# EAGLE design Fathom-S (EAGLE 7.4.0)

## Sheet 1 of 8
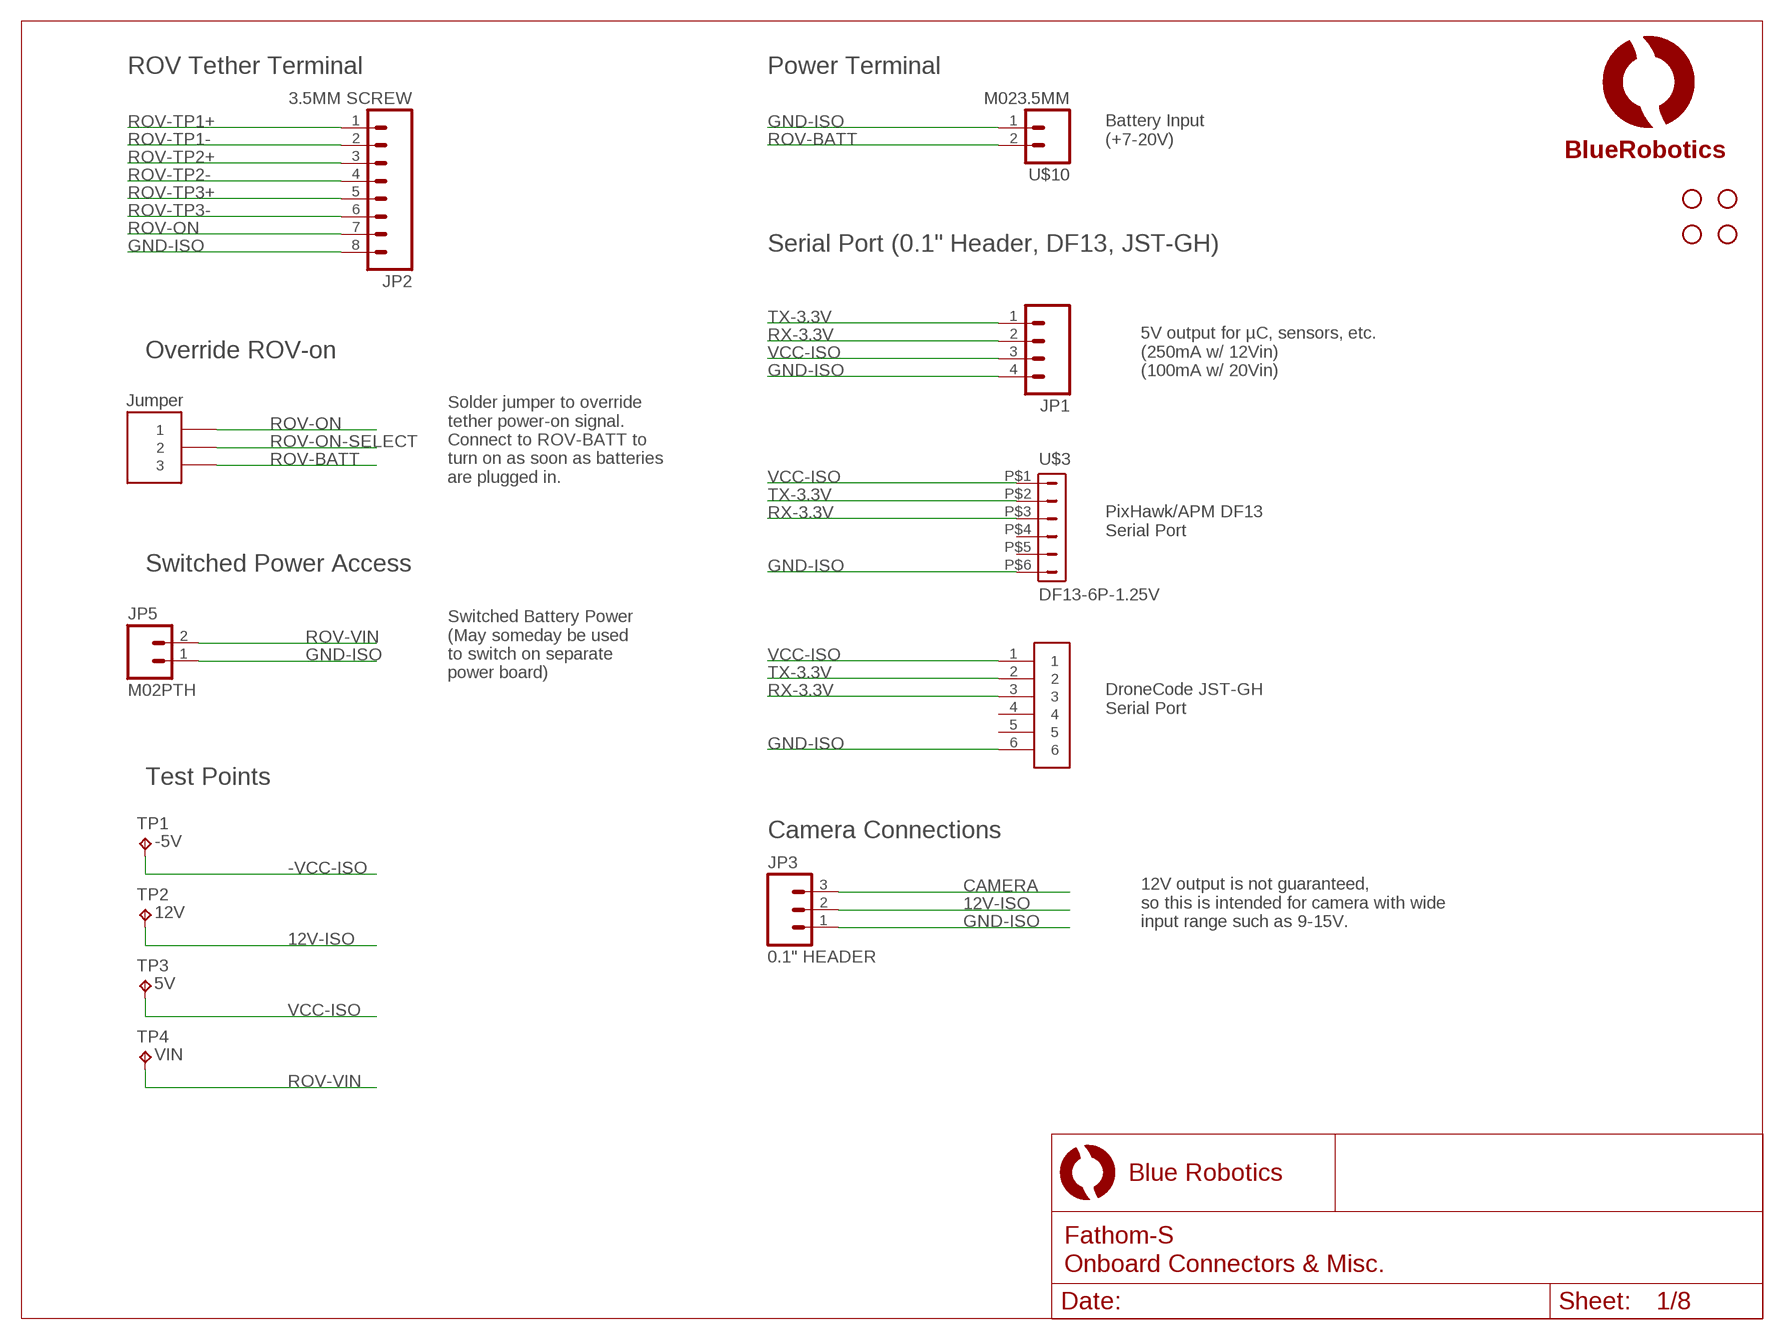
[diagram p0: schematic, sheet 1]

### Parts
JP1  M04PTH  [1X04]
JP2  3.5MM SCREW  M083.5MM-8  [SCREWTERMINAL-3.5MM-8]
JP3  0.1" HEADER  M03PTH  [1X03]
JP5  M02PTH  [1X02]
STANDOFF1  STAND-OFF  [STAND-OFF]
STANDOFF2  STAND-OFF  [STAND-OFF]
STANDOFF3  STAND-OFF  [STAND-OFF]
STANDOFF4  STAND-OFF  [STAND-OFF]
TP1  -5V  TEST-POINT  [B1,27]
TP2  12V  TEST-POINT  [B1,27]
TP3  5V  TEST-POINT  [B1,27]
TP4  VIN  TEST-POINT  [B1,27]
U$3  DF13-6P-1.25V  [DF13C-6P-1.25V]
U$4  LOGOFULL-M  [BR-FULL-LOGO-MEDIUM]
U$10  M023.5MM  [SCREWTERMINAL-3.5MM-2]
U$11  JST-GH-6TOP-ENTRY  [JST-GH-TOP-6]
U$13  HEADER-33MM  [HEADER-2MM-3POS]

### Nets
12V-ISO: JP3.2 TP2.TP ; also sheet 4
-VCC-ISO: TP1.TP ; also sheet 4,6
CAMERA: JP3.3 ; also sheet 6
GND-ISO: JP1.4 JP2.8 JP3.1 JP5.1 U$3.P$6 U$10.1 U$11.6 ; also sheet 3,4,5,6,8
ROV-BATT: U$10.2 U$13.P$3 ; also sheet 5
ROV-ON: JP2.7 U$13.P$1
ROV-ON-SELECT: U$13.P$2 ; also sheet 5
ROV-TP1+: JP2.1 ; also sheet 6
ROV-TP1-: JP2.2 ; also sheet 6
ROV-TP2+: JP2.3 ; also sheet 8
ROV-TP2-: JP2.4 ; also sheet 8
ROV-TP3+: JP2.5 ; also sheet 8
ROV-TP3-: JP2.6 ; also sheet 8
ROV-VIN: JP5.2 TP4.TP ; also sheet 4,5
RX-3.3V: JP1.2 U$3.P$3 U$11.3 ; also sheet 8
TX-3.3V: JP1.1 U$3.P$2 U$11.2 ; also sheet 8
VCC-ISO: JP1.3 TP3.TP U$3.P$1 U$11.1 ; also sheet 3,4,6,8
Unconnected: U$3.P$4 U$3.P$5 U$11.4 U$11.5

### Notes on the sheet
- ROV Tether Terminal | Power Terminal
- Battery Input
  (+7-20V)
- Serial Port (0.1" Header, DF13, JST-GH)
- Override ROV-on
- 5V output for µC, sensors, etc.
  (250mA w/ 12Vin)
  (100mA w/ 20Vin)
- Jumper
- Solder jumper to override
  tether power-on signal. 
  Connect to ROV-BATT to 
  turn on as soon as batteries
  are plugged in.
- PixHawk/APM DF13
  Serial Port
- Switched Power Access
- Switched Battery Power
  (May someday be used
  to switch on separate
  power board)
- DroneCode JST-GH
  Serial Port
- Test Points
- Camera Connections
- 12V output is not guaranteed, 
  so this is intended for camera with wide 
  input range such as 9-15V.

## Sheet 2 of 8
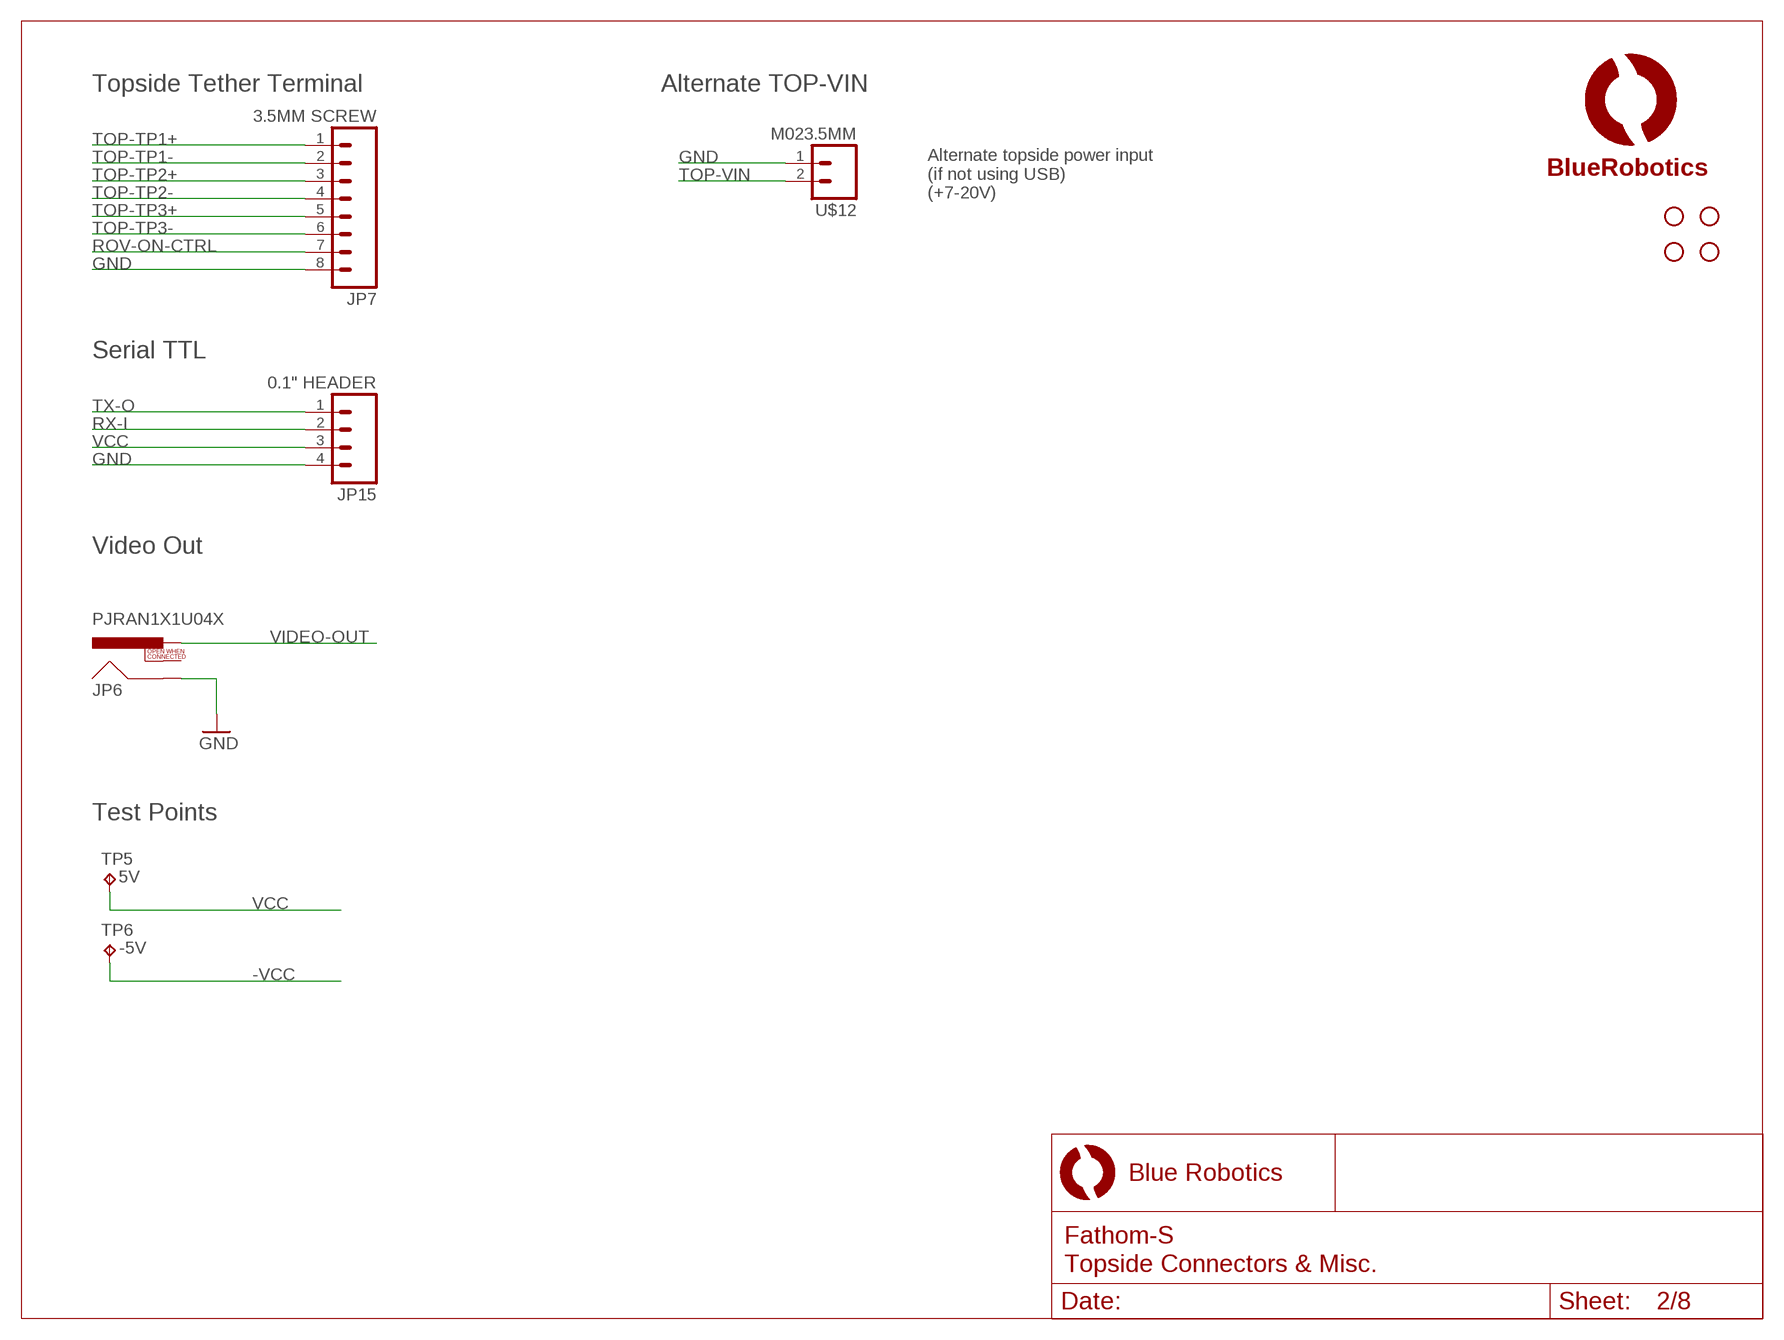
[diagram p1: schematic, sheet 2]

### Parts
JP6  PJRAN1X1U04X  RCA  [RCA]
JP7  3.5MM SCREW  M083.5MM-8  [SCREWTERMINAL-3.5MM-8]
JP15  0.1" HEADER  M04PTH  [1X04]
STANDOFF5  STAND-OFF  [STAND-OFF]
STANDOFF6  STAND-OFF  [STAND-OFF]
STANDOFF7  STAND-OFF  [STAND-OFF]
STANDOFF8  STAND-OFF  [STAND-OFF]
TP5  5V  TEST-POINT  [B1,27]
TP6  -5V  TEST-POINT  [B1,27]
U$5  LOGOBR-LOGO-MS-COPPER  [BR-LOGO-MEDIUM-SMALL-COPPER]
U$12  M023.5MM  [SCREWTERMINAL-3.5MM-2]

### Nets
-VCC: TP6.TP ; also sheet 4,6
GND: JP6.SHELL JP7.8 JP15.4 U$12.1 ; also sheet 3,4,6,7
ROV-ON-CTRL: JP7.7 ; also sheet 7
RX-I: JP15.2 ; also sheet 7
TOP-TP1+: JP7.1 ; also sheet 6
TOP-TP1-: JP7.2 ; also sheet 6
TOP-TP2+: JP7.3 ; also sheet 7
TOP-TP2-: JP7.4 ; also sheet 7
TOP-TP3+: JP7.5 ; also sheet 7
TOP-TP3-: JP7.6 ; also sheet 7
TOP-VIN: U$12.2 ; also sheet 4
TX-O: JP15.1 ; also sheet 7
VCC: JP15.3 TP5.TP ; also sheet 3,4,6,7
VIDEO-OUT: JP6.PIN ; also sheet 6
Unconnected: JP6.SWITCH

### Notes on the sheet
- Topside Tether Terminal | Alternate TOP-VIN
- Alternate topside power input 
  (if not using USB)
  (+7-20V)
- Serial TTL
- Video Out
- Test Points

## Sheet 3 of 8
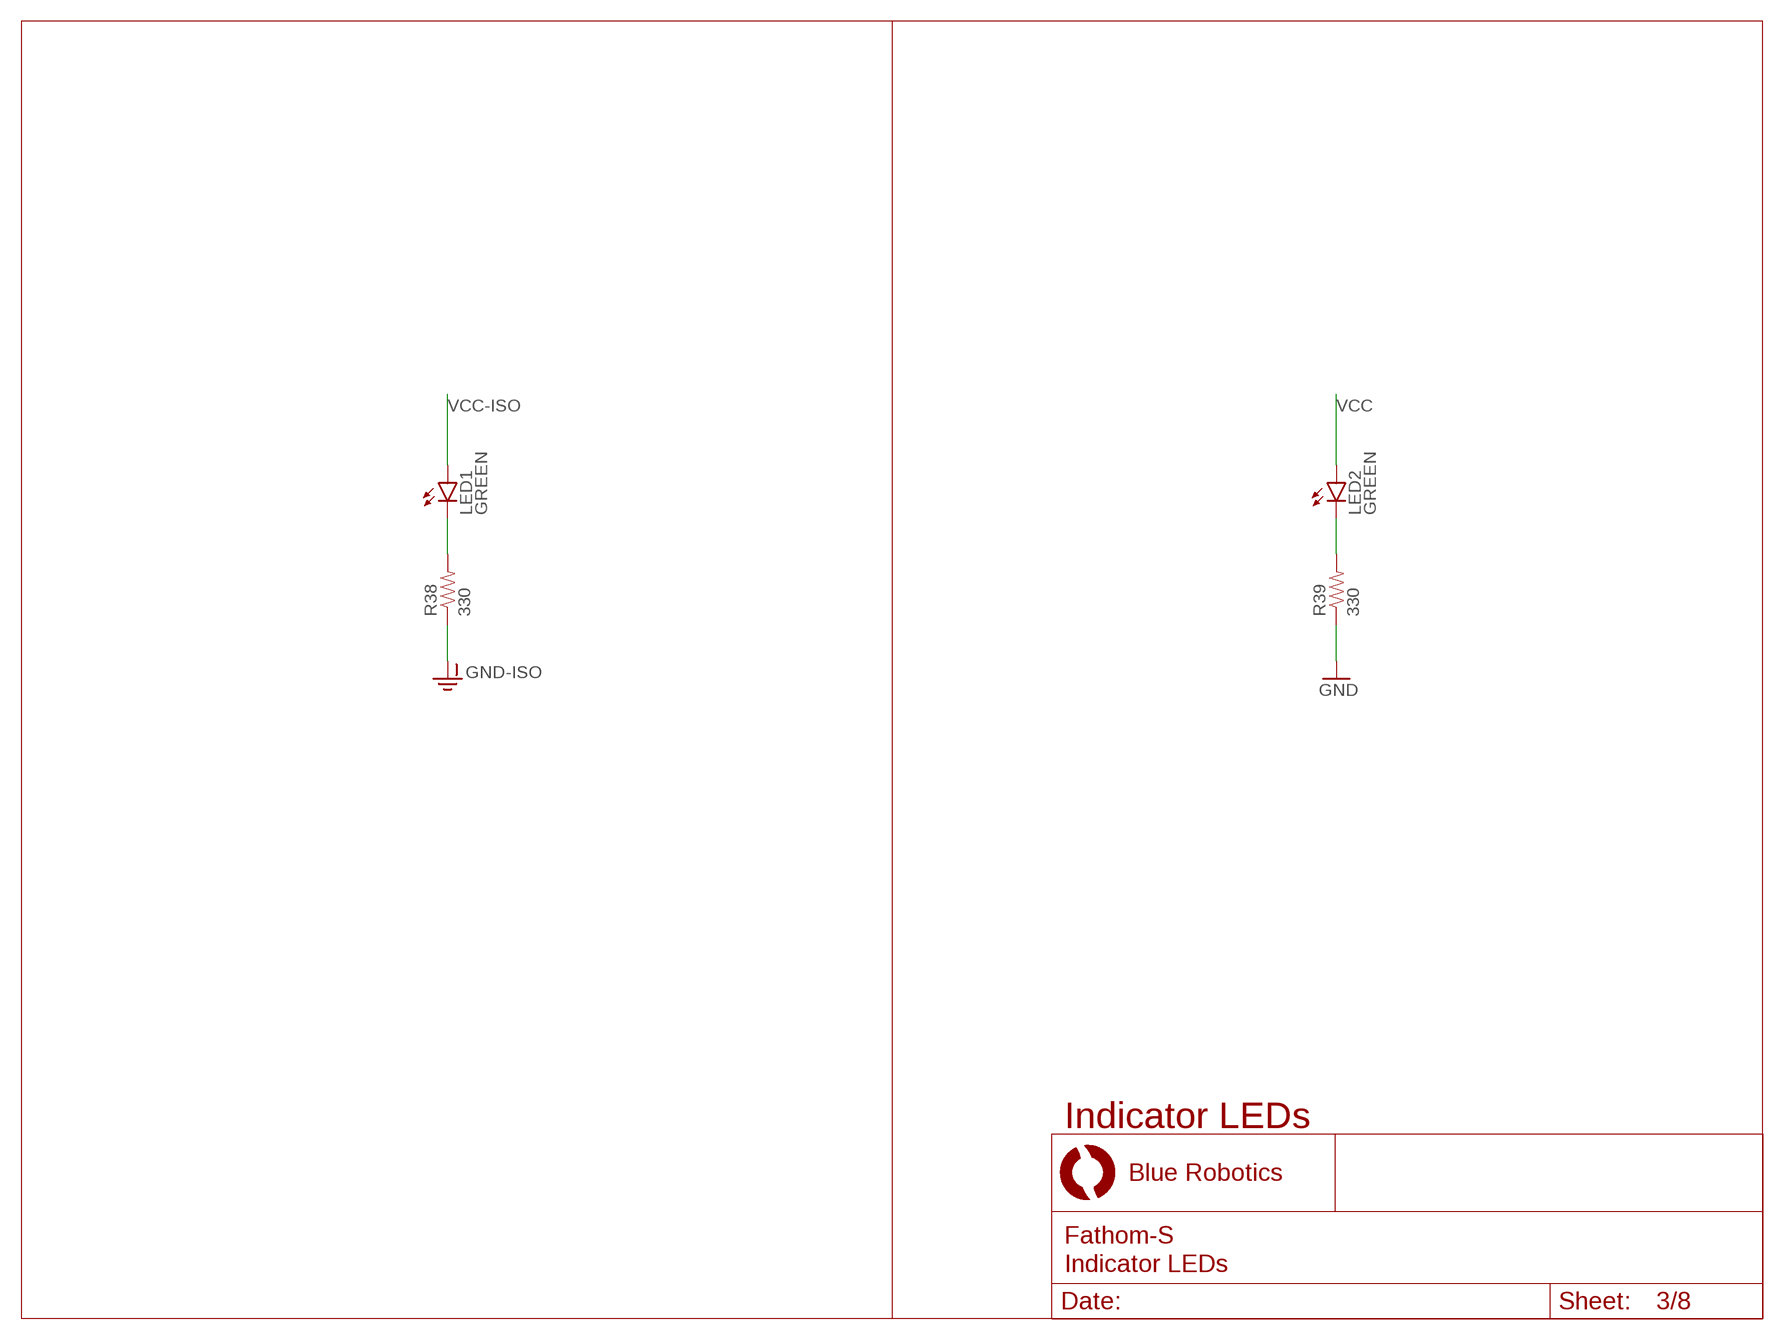
[diagram p2: schematic, sheet 3]

### Parts
LED1  GREEN  LED0603  [LED-0603]
LED2  GREEN  LED0603  [LED-0603]
R38  330  33KOHM1/10W1%(0603)  [0603-RES]
R39  330  33KOHM1/10W1%(0603)  [0603-RES]

### Nets
GND: R39.1 ; also sheet 2,4,6,7
GND-ISO: R38.1 ; also sheet 1,4,5,6,8
N$31: LED1.C R38.2
N$32: LED2.C R39.2
VCC: LED2.A ; also sheet 2,4,6,7
VCC-ISO: LED1.A ; also sheet 1,4,6,8

### Notes on the sheet
- Indicator LEDs

## Sheet 4 of 8
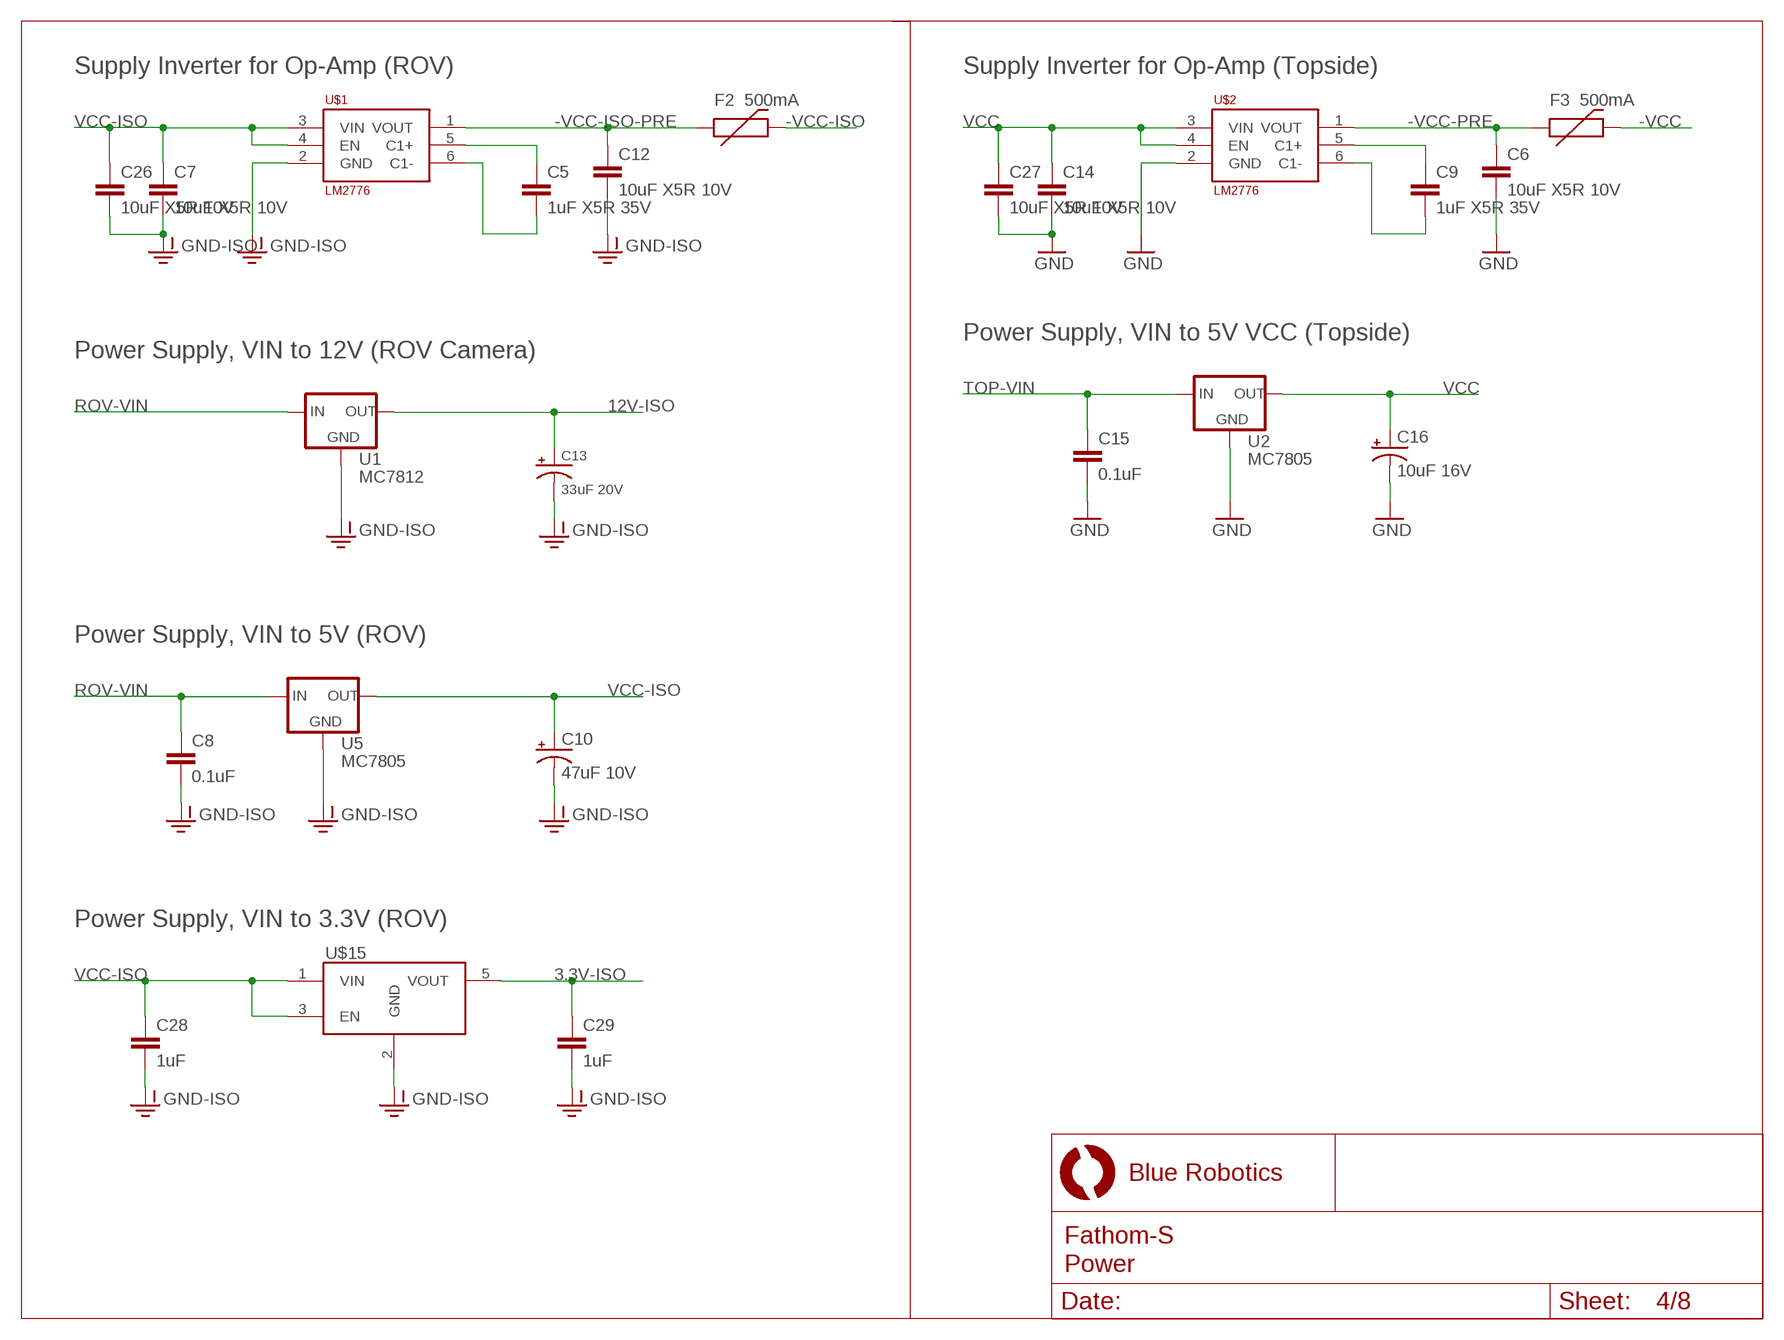
[diagram p3: schematic, sheet 4]

### Parts
C5  1uF X5R 35V  CAP0603-CAP  [0603-CAP]
C6  10uF X5R 10V  CAP0805  [0805]
C7  10uF X5R 10V  CAP0805  [0805]
C8  0.1uF  CAP0603-CAP  [0603-CAP]
C9  1uF X5R 35V  CAP0603-CAP  [0603-CAP]
C10  47uF 10V  CAP_POL3528  [EIA3528]
C12  10uF X5R 10V  CAP0805  [0805]
C13  33uF 20V  CAPACITOR-POLAR2413  [C2413]
C14  10uF X5R 10V  CAP0805  [0805]
C15  0.1uF  CAP0603-CAP  [0603-CAP]
C16  10uF 16V  CAP_POL1206  [EIA3216]
C26  10uF X5R 10V  CAP0805  [0805]
C27  10uF X5R 10V  CAP0805  [0805]
C28  1uF  CAP0603-CAP  [0603-CAP]
C29  1uF  CAP0603-CAP  [0603-CAP]
F2  500mA  PTC0603  [0603]
F3  500mA  PTC0603  [0603]
U1  MC7812  78XX  [DPAK]
U2  MC7805  78XX  [DPAK]
U5  MC7805  78XX  [DPAK]
U$1  LM2776  [SOT-23-6]
U$2  LM2776  [SOT-23-6]
U$15  VREG-MIC5365  [SC70-5L]

### Nets
3.3V-ISO: C29.1 U$15.5(VOUT) ; also sheet 8
12V-ISO: C13.+ U1.3(OUT) ; also sheet 1
-VCC: F3.2 ; also sheet 2,6
-VCC-ISO: F2.2 ; also sheet 1,6
-VCC-ISO-PRE: C12.1 F2.1 U$1.1(VOUT)
-VCC-PRE: C6.1 F3.1 U$2.1(VOUT)
GND: C6.2 C14.2 C15.2 C16.C(-) C27.2 U2.4(GND) U$2.2(GND) ; also sheet 2,3,6,7
GND-ISO: C7.2 C8.2 C10.C(-) C12.2 C13.- C26.2 C28.2 C29.2 U1.4(GND) U5.4(GND) U$1.2(GND) U$15.2(GND) ; also sheet 1,3,5,6,8
N$3: C9.1 U$2.5(C1+)
N$4: C9.2 U$2.6(C1-)
N$10: C5.1 U$1.5(C1+)
N$11: C5.2 U$1.6(C1-)
ROV-VIN: C8.1 U1.1(IN) U5.1(IN) ; also sheet 1,5
TOP-VIN: C15.1 U2.1(IN) ; also sheet 2
VCC: C14.1 C16.A(+) C27.1 U2.3(OUT) U$2.3(VIN) U$2.4(EN) ; also sheet 2,3,6,7
VCC-ISO: C7.1 C10.A(+) C26.1 C28.1 U5.3(OUT) U$1.3(VIN) U$1.4(EN) U$15.1(VIN) U$15.3(EN) ; also sheet 1,3,6,8

### Notes on the sheet
- Supply Inverter for Op-Amp (ROV) | Supply Inverter for Op-Amp (Topside)
- Power Supply, VIN to 5V VCC (Topside)
- Power Supply, VIN to 12V (ROV Camera)
- Power Supply, VIN to 5V (ROV)
- Power Supply, VIN to 3.3V (ROV)

## Sheet 5 of 8
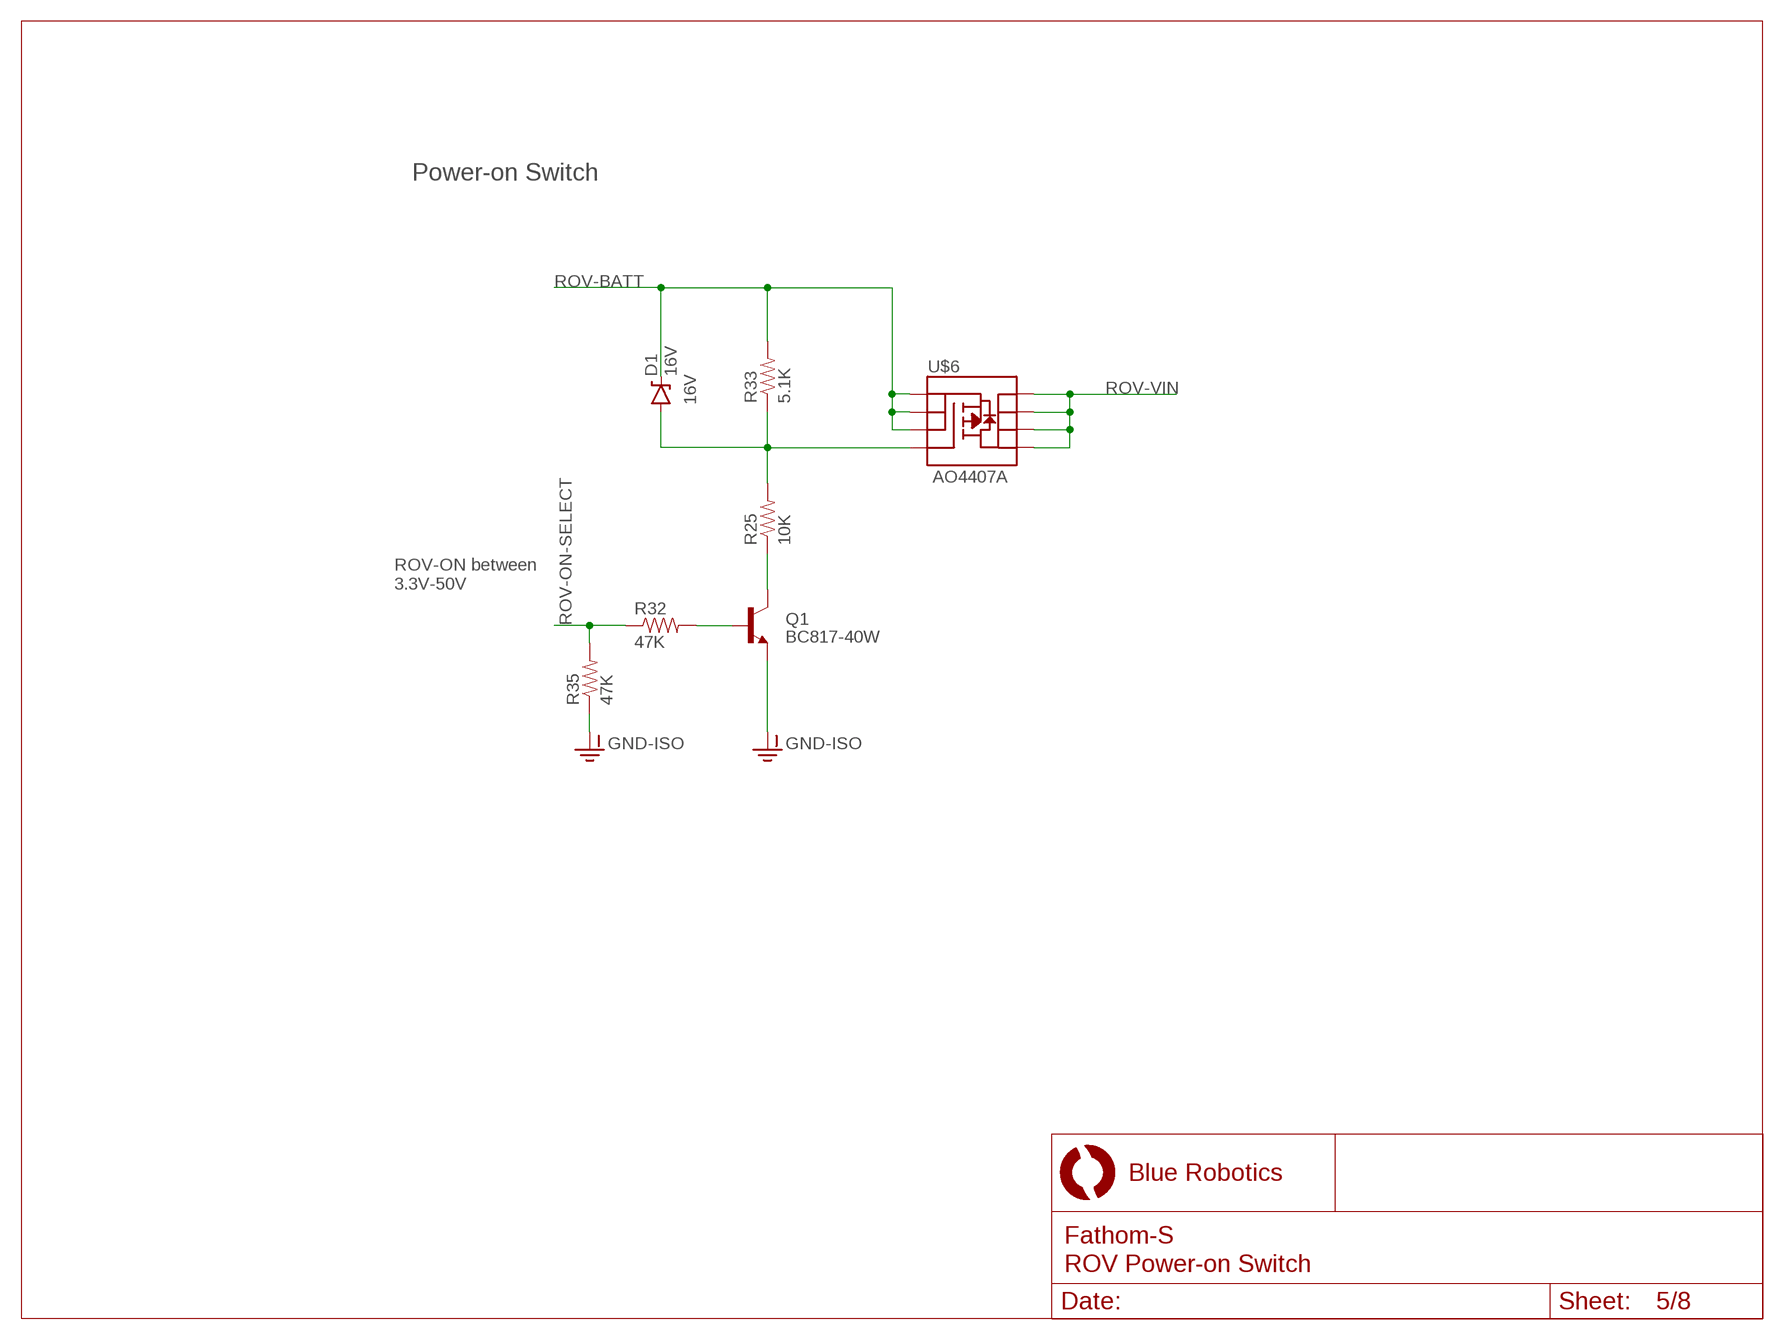
[diagram p4: schematic, sheet 5]

### Parts
D1  16V  DIODE-ZENER3.3V  [SOD-323]
Q1  BC817-40W  TRANSISTOR_NPNSOT23  [SOT23]
R25  10K  33KOHM1/10W1%(0603)  [0603-RES]
R32  47K  33KOHM1/10W1%(0603)  [0603-RES]
R33  5.1K  33KOHM1/10W1%(0603)  [0603-RES]
R35  47K  33KOHM1/10W1%(0603)  [0603-RES]
U$6  AO4407A  MOSFET-PCHANNEL-SOIC8SOIC8  [SO08]

### Nets
GND-ISO: Q1.2(E) R35.1 ; also sheet 1,3,4,6,8
N$27: Q1.1(B) R32.2
N$28: D1.A R25.2 R33.1 U$6.4(G)
N$30: Q1.3(C) R25.1
ROV-BATT: D1.C R33.2 U$6.1(S) U$6.2(S) U$6.3(S) ; also sheet 1
ROV-ON-SELECT: R32.1 R35.2 ; also sheet 1
ROV-VIN: U$6.5(D) U$6.6(D) U$6.7(D) U$6.8(D) ; also sheet 1,4

### Notes on the sheet
- Power-on Switch
- 16V
- ROV-ON between
  3.3V-50V

## Sheet 6 of 8
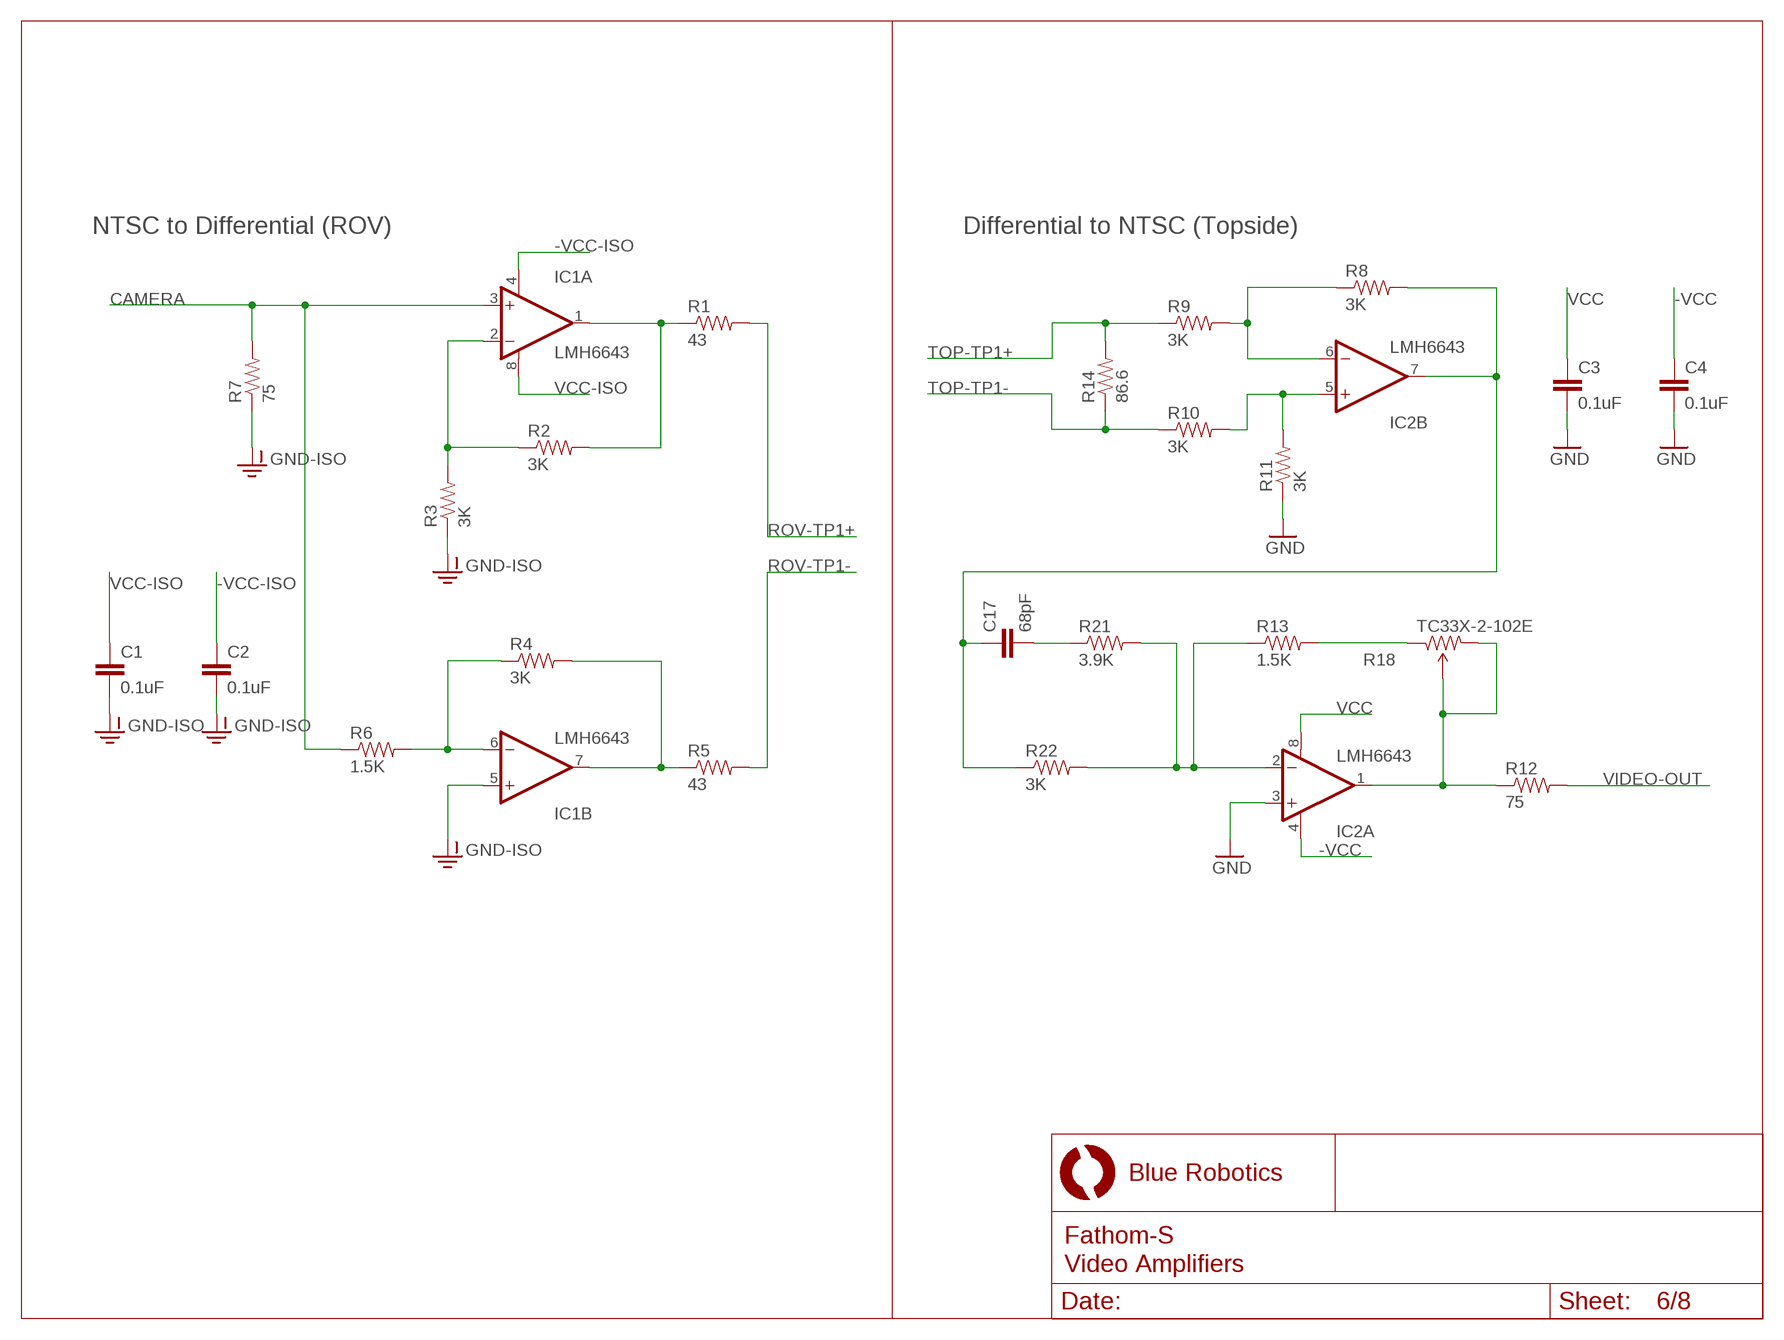
[diagram p5: schematic, sheet 6]

### Parts
C1  0.1uF  CAP0603-CAP  [0603-CAP]
C2  0.1uF  CAP0603-CAP  [0603-CAP]
C3  0.1uF  CAP0603-CAP  [0603-CAP]
C4  0.1uF  CAP0603-CAP  [0603-CAP]
C17  68pF  CAP0603-CAP  [0603-CAP]
IC1  LMH6643  OPAMP-DUALMSOP  [MSOP8]
IC2  LMH6643  OPAMP-DUALMSOP  [MSOP8]
R1  43  RESISTOR0603-RES  [0603-RES]
R2  3K  RESISTOR0603-RES  [0603-RES]
R3  3K  RESISTOR0603-RES  [0603-RES]
R4  3K  RESISTOR0603-RES  [0603-RES]
R5  43  RESISTOR0603-RES  [0603-RES]
R6  1.5K  RESISTOR0603-RES  [0603-RES]
R7  75  RESISTOR0603-RES  [0603-RES]
R8  3K  RESISTOR0603-RES  [0603-RES]
R9  3K  RESISTOR0603-RES  [0603-RES]
R10  3K  RESISTOR0603-RES  [0603-RES]
R11  3K  RESISTOR0603-RES  [0603-RES]
R12  75  RESISTOR0603-RES  [0603-RES]
R13  1.5K  RESISTOR0603-RES  [0603-RES]
R14  86.6  RESISTOR0603-RES  [0603-RES]
R18  TC33X-2-102E  TRIMPOT-2  [TRIMPOT_TC33]
R21  3.9K  RESISTOR0603-RES  [0603-RES]
R22  3K  RESISTOR0603-RES  [0603-RES]

### Nets
-VCC: C4.1 IC2.4(A:V-) ; also sheet 2,4
-VCC-ISO: C2.1 IC1.4(A:V-) ; also sheet 1,4
CAMERA: IC1.3(A:+IN) R6.1 R7.2 ; also sheet 1
GND: C3.2 C4.2 IC2.3(A:+IN) R11.1 ; also sheet 2,3,4,7
GND-ISO: C1.2 C2.2 IC1.5(B:+IN) R3.1 R7.1 ; also sheet 1,3,4,5,8
N$1: IC1.1(A:OUT) R1.1 R2.2
N$2: IC1.7(B:OUT) R4.2 R5.1
N$5: IC1.2(A:-IN) R2.1 R3.2
N$6: IC1.6(B:-IN) R4.1 R6.2
N$8: IC2.5(B:+IN) R10.2 R11.2
N$9: IC2.6(B:-IN) R8.1 R9.2
N$12: R13.2 R18.1(CCW)
N$14: C17.1 IC2.7(B:OUT) R8.2 R22.1
N$15: IC2.2(A:-IN) R13.1 R21.2 R22.2
N$16: C17.2 R21.1
N$17: IC2.1(A:OUT) R12.1 R18.2(WIPER) R18.3(CW)
ROV-TP1+: R1.2 ; also sheet 1
ROV-TP1-: R5.2 ; also sheet 1
TOP-TP1+: R9.1 R14.2 ; also sheet 2
TOP-TP1-: R10.1 R14.1 ; also sheet 2
VCC: C3.1 IC2.8(A:V+) ; also sheet 2,3,4,7
VCC-ISO: C1.1 IC1.8(A:V+) ; also sheet 1,3,4,8
VIDEO-OUT: R12.2 ; also sheet 2

### Notes on the sheet
- NTSC to Differential (ROV) | Differential to NTSC (Topside)

## Sheet 7 of 8
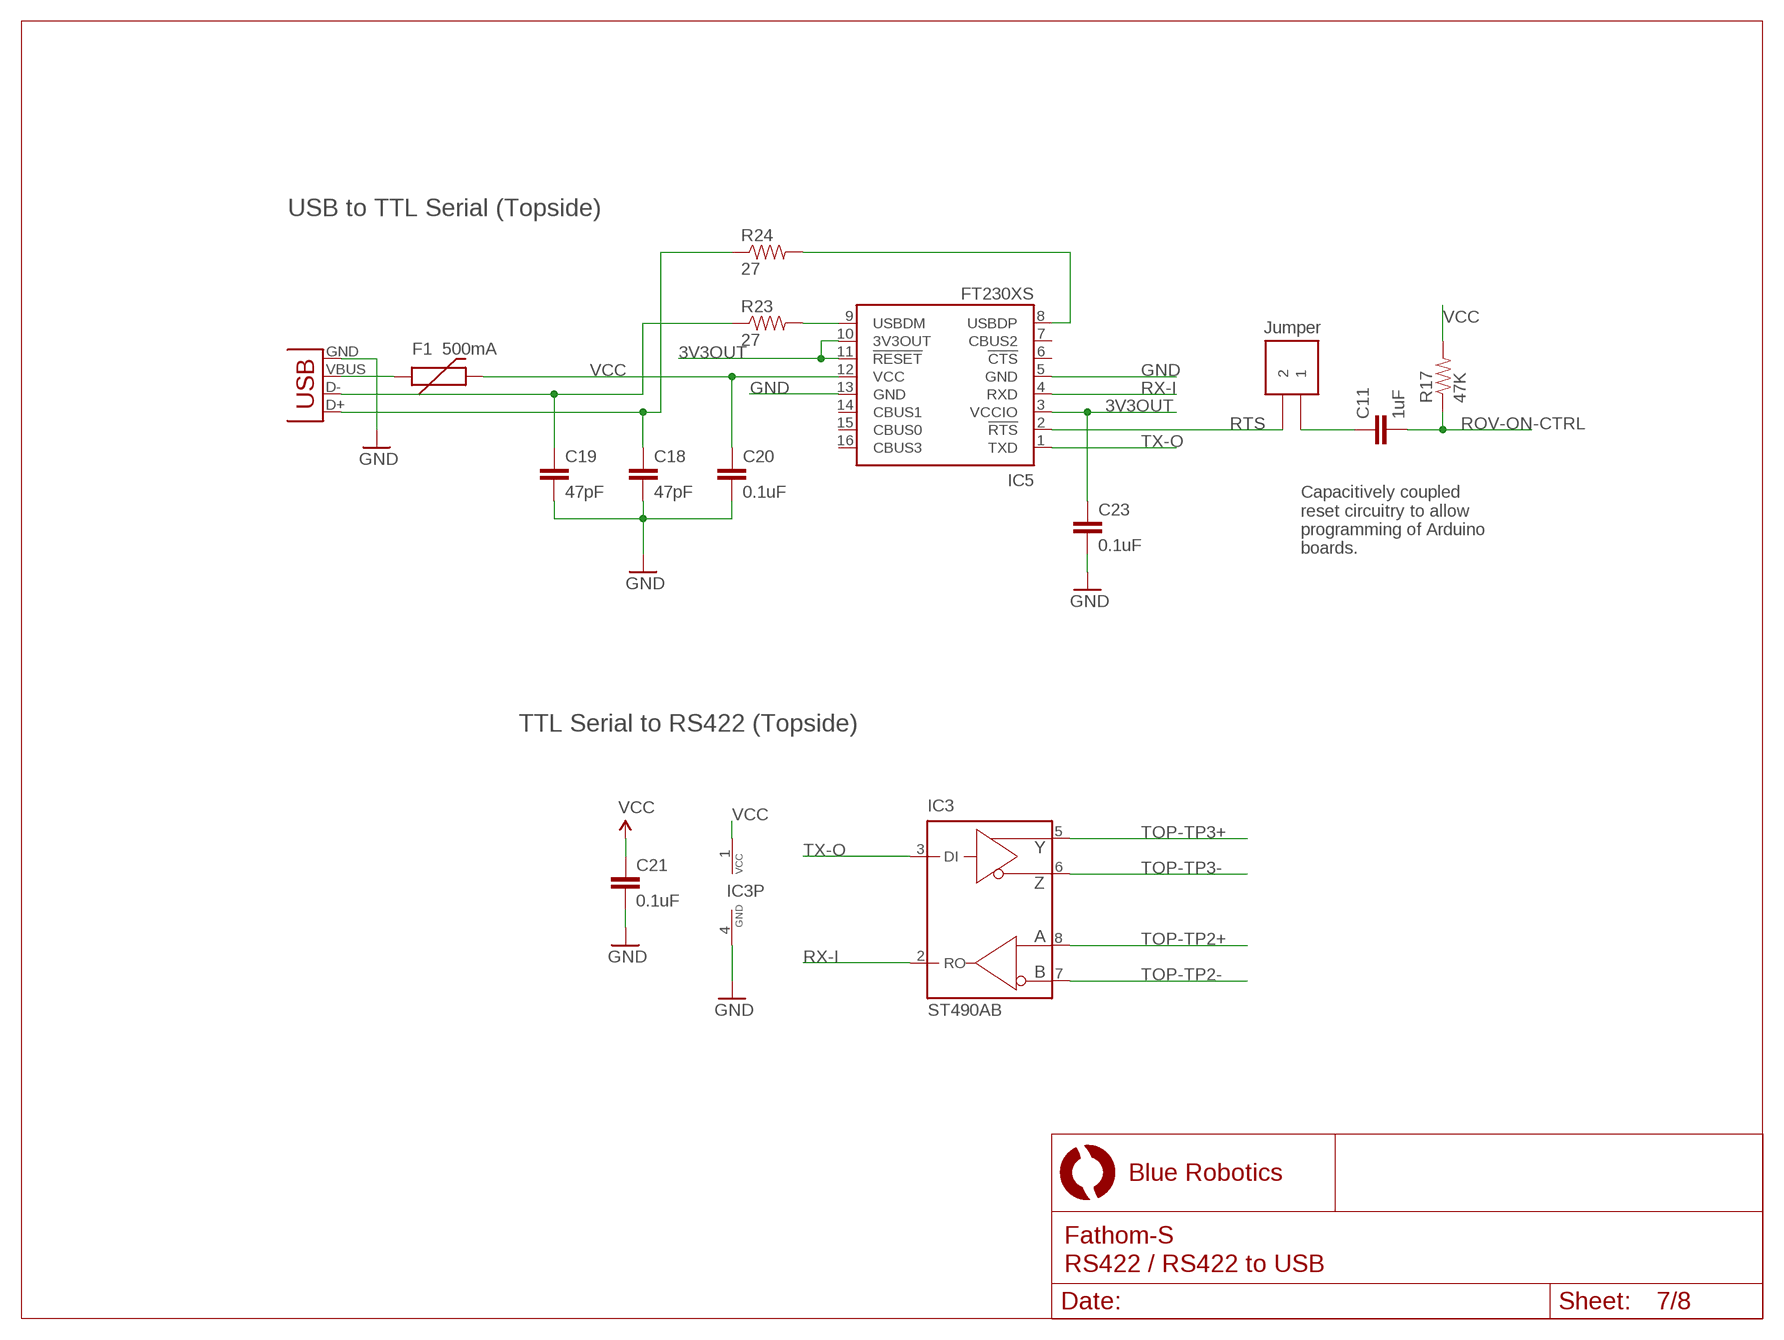
[diagram p6: schematic, sheet 7]

### Parts
C11  1uF  CAP0603-CAP  [0603-CAP]
C18  47pF  CAP0603-CAP  [0603-CAP]
C19  47pF  CAP0603-CAP  [0603-CAP]
C20  0.1uF  CAP0603-CAP  [0603-CAP]
C21  0.1uF  CAP0603-CAP  [0603-CAP]
C23  0.1uF  CAP0603-CAP  [0603-CAP]
F1  500mA  PTC0603  [0603]
IC3  ST490AB  MAX488CSA  [SO08]
IC5  FT230XS  [SSOP16]
R17  47K  RESISTOR0603-RES  [0603-RES]
R23  27  RESISTOR0603-RES  [0603-RES]
R24  27  RESISTOR0603-RES  [0603-RES]
U$16  HEADER-22MM  [HEADER-2MM-2POS]
X2  USBSMD  [USB-MINIB]

### Nets
3V3OUT: C23.1 IC5.3(VCCIO) IC5.10(3V3OUT) IC5.11(!RESET)
GND: C18.2 C19.2 C20.2 C21.2 C23.2 IC3.4(GND) IC5.5(GND) IC5.13(GND) X2.GND ; also sheet 2,3,4,6
N$7: C11.1 U$16.P$1
N$19: C19.1 R23.1 X2.D-
N$20: C18.1 R24.1 X2.D+
N$21: F1.1 X2.VBUS
N$22: IC5.8(USBDP) R24.2
N$29: IC5.9(USBDM) R23.2
ROV-ON-CTRL: C11.2 R17.1 ; also sheet 2
RTS: IC5.2(!RTS) U$16.P$2
RX-I: IC3.2(RO) IC5.4(RXD) ; also sheet 2
TOP-TP2+: IC3.8(A) ; also sheet 2
TOP-TP2-: IC3.7(B) ; also sheet 2
TOP-TP3+: IC3.5(Y) ; also sheet 2
TOP-TP3-: IC3.6(Z) ; also sheet 2
TX-O: IC3.3(DI) IC5.1(TXD) ; also sheet 2
VCC: C20.1 C21.1 F1.2 IC3.1(VCC) IC5.12(VCC) R17.2 ; also sheet 2,3,4,6
Unconnected: IC5.6(!CTS) IC5.7(CBUS2) IC5.14(CBUS1) IC5.15(CBUS0) IC5.16(CBUS3)

### Notes on the sheet
- USB to TTL Serial (Topside)
- Jumper
- Capacitively coupled
  reset circuitry to allow
  programming of Arduino
  boards.
- TTL Serial to RS422 (Topside)

## Sheet 8 of 8
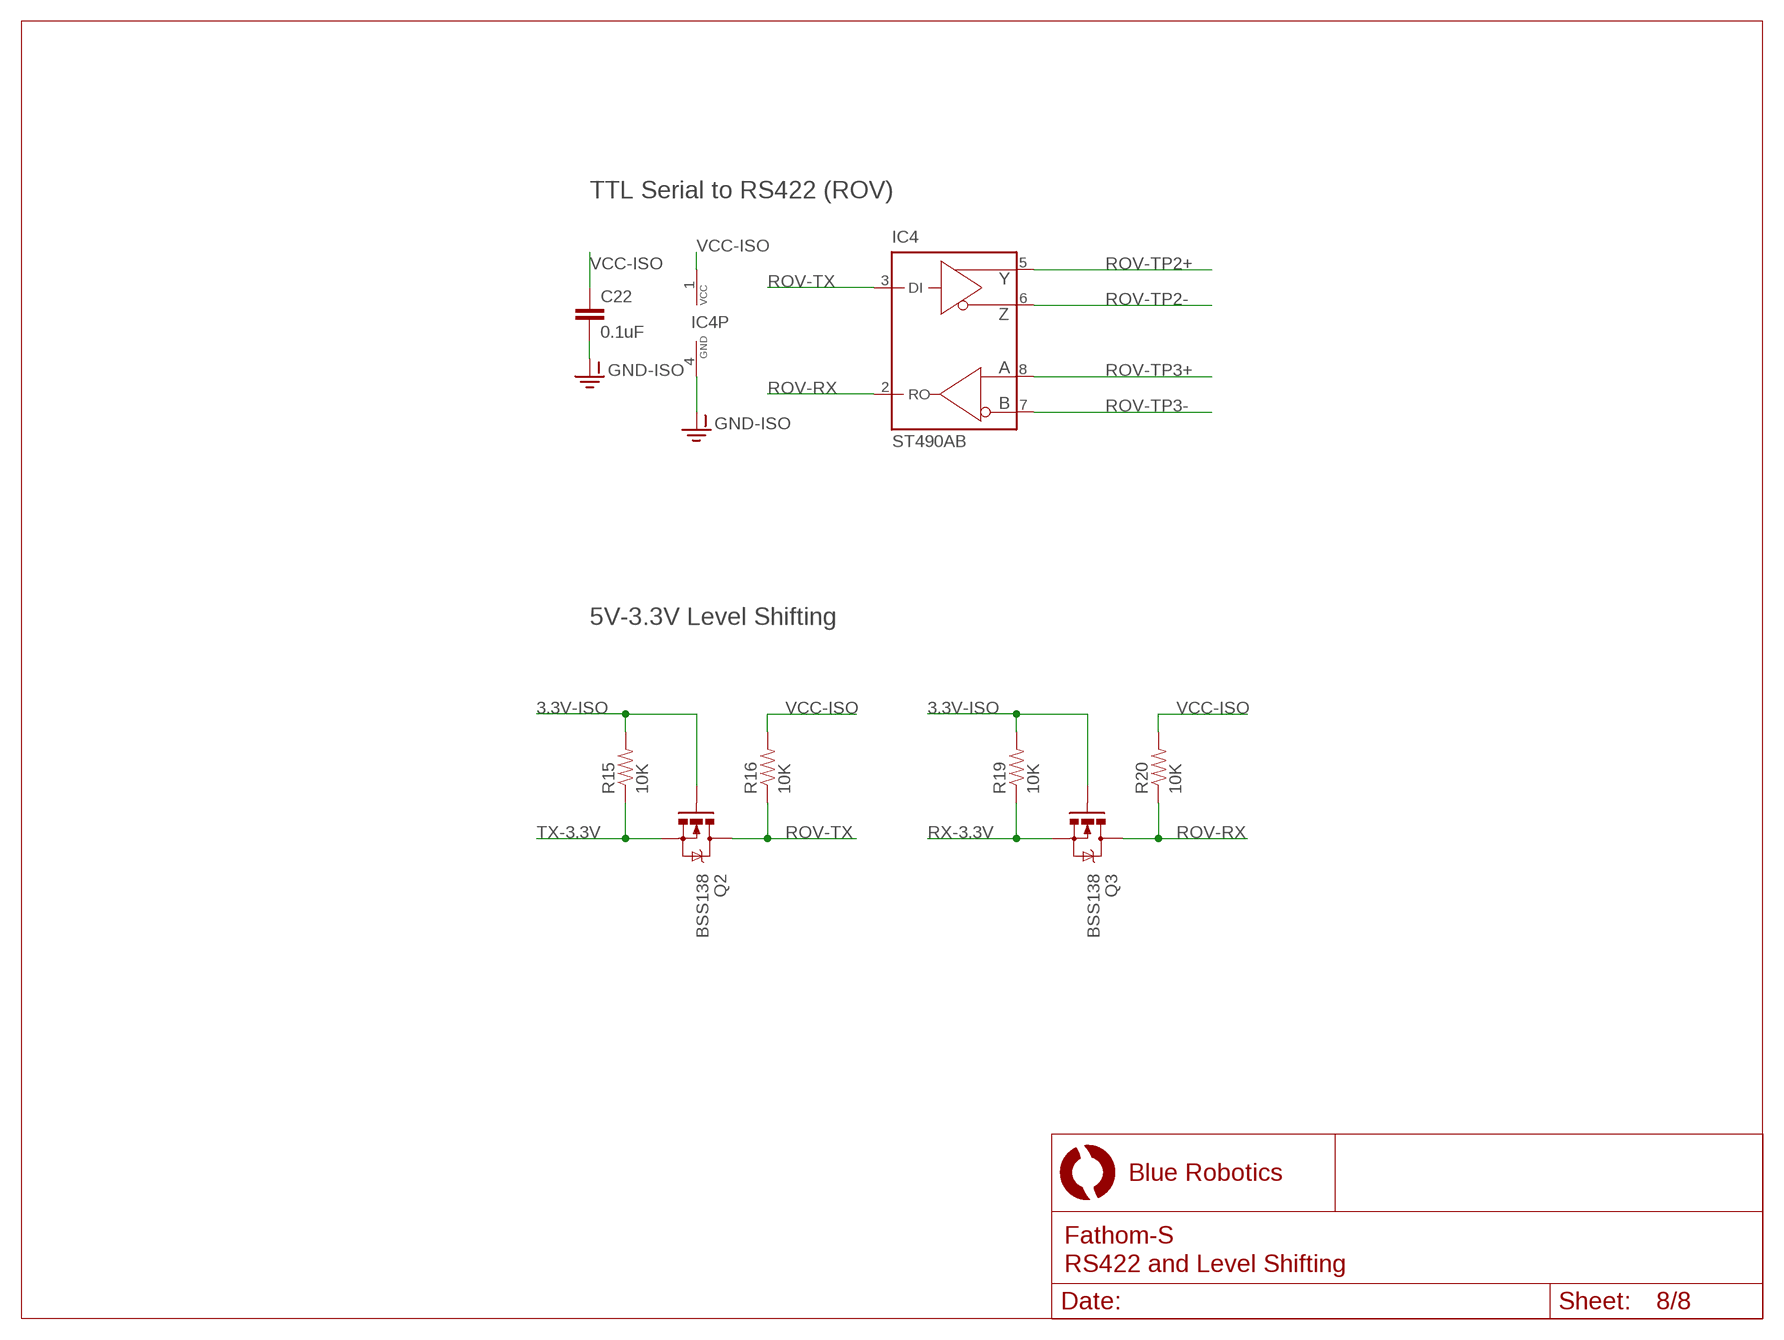
[diagram p7: schematic, sheet 8]

### Parts
C22  0.1uF  CAP0603-CAP  [0603-CAP]
IC4  ST490AB  MAX488CSA  [SO08]
Q2  BSS138  MOSFET-NCHANNELBSS138  [SOT23]
Q3  BSS138  MOSFET-NCHANNELBSS138  [SOT23]
R15  10K  RESISTOR0603-RES  [0603-RES]
R16  10K  RESISTOR0603-RES  [0603-RES]
R19  10K  RESISTOR0603-RES  [0603-RES]
R20  10K  RESISTOR0603-RES  [0603-RES]

### Nets
3.3V-ISO: Q2.1(G) Q3.1(G) R15.2 R19.2 ; also sheet 4
GND-ISO: C22.2 IC4.4(GND) ; also sheet 1,3,4,5,6
ROV-RX: IC4.2(RO) Q3.3(D) R20.1
ROV-TP2+: IC4.5(Y) ; also sheet 1
ROV-TP2-: IC4.6(Z) ; also sheet 1
ROV-TP3+: IC4.8(A) ; also sheet 1
ROV-TP3-: IC4.7(B) ; also sheet 1
ROV-TX: IC4.3(DI) Q2.3(D) R16.1
RX-3.3V: Q3.2(S) R19.1 ; also sheet 1
TX-3.3V: Q2.2(S) R15.1 ; also sheet 1
VCC-ISO: C22.1 IC4.1(VCC) R16.2 R20.2 ; also sheet 1,3,4,6

### Notes on the sheet
- TTL Serial to RS422 (ROV)
- 5V-3.3V Level Shifting

## Library data of the parts
C1-C9 C12 C14 C15 C17 C26-C29 = SparkFun-Passives:CAP: Capacitor Standard 0603 ceramic capacitor, and 0.1" leaded capacitor.
C10 C16 = SparkFun-Passives:CAP_POL: Capacitor Polarized These are standard SMD and PTH capacitors. Normally 10uF, 47uF, and 100uF in electrolytic and tantalum varieties. Always verify the external diameter of the through hole cap, it varies with capacity, voltage, and manufacturer. The EIA devices should be standard.
C11 C18-C23 = SparkFun:CAP: Capacitor Standard 0603 ceramic capacitor, and 0.1" leaded capacitor.
C13 = BlueRobotics-Main:CAPACITOR-POLAR
D1 = SparkFun-DiscreteSemi:DIODE-ZENER: Zener Diode Production Part - 8199 3.4V Zener Voltage; PROD_ID: DIO-11284; VALUE: 3.3V
F1-F3 = SparkFun:PTC: Resettable Fuse PTC Resettable Fuse. Spark Fun Electronics SKU : COM-08357
IC1 IC2 = BlueRobotics-Main:OPAMP-DUAL: Generic op-amp footprint
IC3 IC4 = maxim:MAX488: RS485 TRANSEIVER Source: Data sheet <http://datasheets.maxim-ic.com/en/ds/MAX1487-MAX491.pdf>; MF: MAXIM; MPN: MAX488CSA; OC_FARNELL: 3534170; OC_NEWARK: 34C3921
IC5 = ftdichip:FT230X: USB to BASIC UART IC Auto generated by make-symbol-device-package-bsdl.ulp Rev. 43 Source: Data sheet <http://www.ftdichip.com/Support/Documents/DataSheets/ICs/DS_FT230X.pdf>
JP1 JP15 = SparkFun-Connectors:M04: Header 4 Standard 4-pin 0.1" header. Use with straight break away headers (SKU : PRT-00116), right angle break away headers (PRT-00553), swiss pins (PRT-00743), machine pins (PRT-00117), and female headers (PRT-00115). Molex polarized connector foot print use with SKU : PRT-08231 with associated crimp pins and housings. 1MM SMD Version SKU: PRT-10208
JP2 JP7 = SparkFun-Connectors:M08: Header 8 Standard 8-pin 0.1" header. Use with straight break away headers (SKU : PRT-00116), right angle break away headers (PRT-00553), swiss pins (PRT-00743), machine pins (PRT-00117), and female headers (PRT-00115).
JP3 = SparkFun-Connectors:M03: Header 3 Standard 3-pin 0.1" header. Use with straight break away headers (SKU : PRT-00116), right angle break away headers (PRT-00553), swiss pins (PRT-00743), machine pins (PRT-00117), and female headers (PRT-00115). Molex polarized connector foot print use with SKU : PRT-08232 with associated crimp pins and housings.
JP5 U$10 U$12 = SparkFun-Connectors:M02: Standard 2-pin 0.1" header. Use with - straight break away headers ( PRT-00116) - right angle break away headers (PRT-00553) - swiss pins (PRT-00743) - machine pins (PRT-00117) - female headers (PRT-00115) Molex polarized connector foot print use with: PRT-08233 with associated crimp pins and housings. 2.54_SCREWTERM for use with PRT-10571. 3.5mm Screw Terminal footprints for PRT-08084 5mm Screw Terminal footprints for use with PRT-08433
JP6 = BlueRobotics-Main:RCA
LED1 LED2 = SparkFun-LED:LED: LEDs Standard schematic elements and footprints for 5mm, 3mm, 1206, and 0603 sized LEDs. 5mm - Spark Fun Electronics SKU : COM-00529 (and others)
Q1 = SparkFun-DiscreteSemi:TRANSISTOR_NPN: Generic NPN BJT MMBT2222A - TRANS-08049 (SOT-23, 1A 40V) MPSA42 - TRANS-09116 (SOT-23, 500mA 300V) MMBT5088LT1G - TRANS-11160 (SOT-23, 50 mA 30V) BC547 - COM-08928 <http://www.sparkfun.com/products/8928> (TO-92 45V 100mA) (1.Collector 2.Base 3.Emitter) 2N3904 - COM-00521 <http://www.sparkfun.com/products/521> (TO-92 40V 200mA) (1.Emitter 2.Base 3.Collector) P2N2222A - COM-12852 <http://www.sparkfun.com/products/12852> (TO-92 40V 600mA) (1.Collector 2.Base 3.Emitter)
Q2 Q3 = SparkFun-DiscreteSemi:MOSFET-NCHANNEL: Common NMOSFET Parts MFG P/N Store ID Prod ID FDD8780 TRANS-09984 SI7820DN TRANS-11055 FDS6630A IC-08089 2N7002PW TRANS-11151 FQP30N06L COM-10213 TRANS-10060 BSS123LT1G TRANS-08345 BSS138 TRANS-00830 BS170 2N7000; PROD_ID: TRANS-00830
R1-R14 R21 R22 = SparkFun-Passives:RESISTOR: Resistor
R15-R17 R19 R20 R23 R24 = SparkFun:RESISTOR: Resistor
R18 = SparkFun-Electromechanical:TRIMPOT: Various small potentiometers for "set-and-forget" applications
R25 R32 R33 R35 R38 R39 = SparkFun-Resistors:33KOHM1/10W1%(0603): RES-08416
STANDOFF1-STANDOFF8 = SparkFun-Electromechanical:STAND-OFF: #4 Stand Off This is the mechanical footprint for a #4 phillips button head screw. Use the keepout ring to avoid running the screw head into surrounding components. SKU : PRT-00447
TP1-TP6 = BlueRobotics-Main:TEST-POINT
U1 U2 U5 = BR-Eagle-Library:78XX
U$1 U$2 = BR-Eagle-Library:LM2776
U$3 = con-hirose-df13:DF13-6P-1.25: DF13-6P 1.25mm Pitch Miniature Crimping Connector.
U$4 U$5 = BlueRobotics-Main:LOGO
U$6 = SparkFun-DiscreteSemi:MOSFET-PCHANNEL-SOIC8: Generic 8-pin PMOSFET
U$11 = BlueRobotics-JST-GH:JST-GH-6
U$13 = BlueRobotics-Main:HEADER-3
U$15 = BlueRobotics-Main:VREG-MIC5365
U$16 = BlueRobotics-Main:HEADER-2
X2 = SparkFun:USB: USB Connectors USB-B-PTH is fully proven SKU : PRT-00139 USB-miniB is fully proven SKU : PRT-00587 USB-A-PCB is untested. USB-A-H is throughly reviewed, but untested. Spark Fun Electronics SKU : PRT-00437 USB-B-SMT is throughly reviewed, but untested. Needs silkscreen touching up. USB-A-S has not been used/tested USB-MB-H has not been used/tested

## Net classes
1 power: width 0.254 mm

## Board
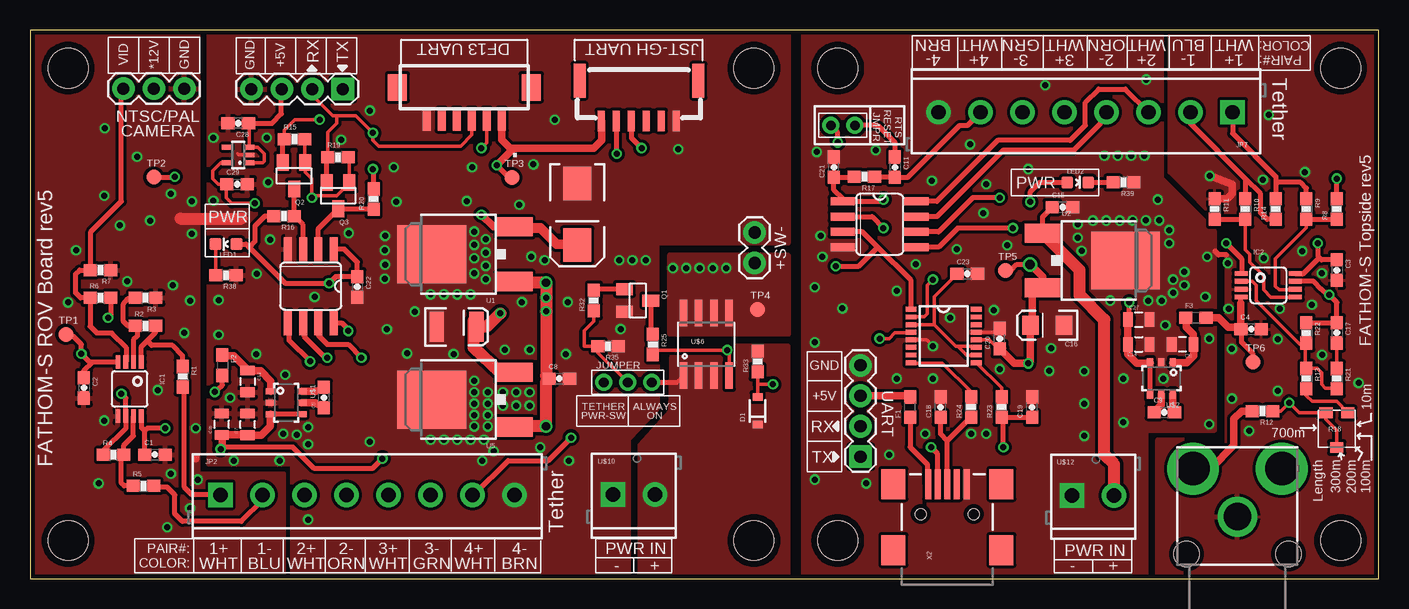
[diagram p8: board, top side]
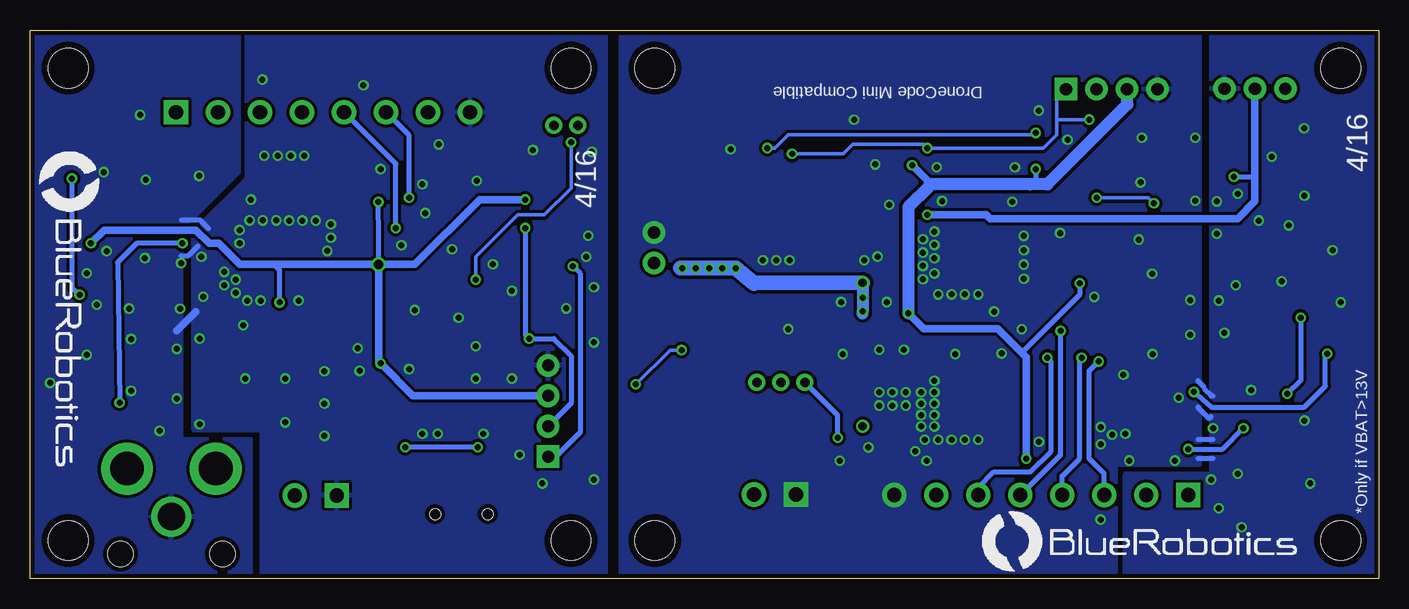
[diagram p9: board, bottom side, seen from below]

Size 112.39 x 45.72 mm. Coordinates in mm from the lower left corner, seen from the top.
Outline: 0,0 112.39,0 112.39,45.72 0,45.72 0,0
Copper layers (1*16): Top 0.0356mm / dielectric 1.5011mm / Bottom 0.0356mm
Design rules "OSH-Park *": minimum track width 6mil, minimum drill 13mil, track to track 6mil, track to pad 6mil, pad to pad 6mil, via to via 6mil, smd to smd 6mil, copper to edge 15mil, drill to drill 6mil, minimum pad ring 7mil, minimum via ring 7mil, stop-mask expansion 3mil, vias tented up to drill 30mil, thermal gap 10mil

### Footprints (pad centres in the part's own frame; a part is rotated, then mirrored left to right if it is on the bottom)
0603-CAP = smd 1.1 x 1: 1 -0.85,0; 2 0.85,0
0805 = smd 0.8 x 1.2: 1 -0.9,0; 2 0.9,0
EIA3528 = smd 1.2 x 2.5: A 1.65,0; C -1.65,0
C2413 = smd 2.77 x 2.35: + 0,0; - 5.14,0
EIA3216 = smd 1.4 x 1.6: A 1.4,0; C -1.4,0
SOD-323 = smd 0.63 x 0.83: A 1.15,0; C -1.15,0
0603 = smd 1.1 x 1: 1 -0.85,0; 2 0.85,0
MSOP8 = smd 0.4 x 1.1: 1 -0.975,-2.25; 2 -0.325,-2.25; 3 0.325,-2.25; 4 0.975,-2.25; 5 0.975,2.25; 6 0.325,2.25; 7 -0.325,2.25; 8 -0.975,2.25
SO08 = smd 0.66 x 2.032: 1 -1.905,-3.073; 2 -0.635,-3.073; 3 0.635,-3.073; 4 1.905,-3.073; 5 1.905,3.073; 6 0.635,3.073; 7 -0.635,3.073; 8 -1.905,3.073
SSOP16 = smd 0.914 x 0.406: 1 -2.718,2.223; 2 -2.718,1.587; 3 -2.718,0.953; 4 -2.718,0.318; 5 -2.718,-0.318; 6 -2.718,-0.953; 7 -2.718,-1.587; 8 -2.718,-2.223; 9 2.718,-2.223; 10 2.718,-1.587; 11 2.718,-0.953; 12 2.718,-0.318; 13 2.718,0.318; 14 2.718,0.953; 15 2.718,1.587; 16 2.718,2.223
1X04 = drill 1.016 pad 1.88 square: 1 0,0 | drill 1.016 pad 1.88: 2 2.54,0; 3 5.08,0; 4 7.62,0
SCREWTERMINAL-3.5MM-8 = drill 1.2 pad 2.032 square: 1 0,0 | drill 1.2 pad 2.032: 2 3.5,0; 3 7,0; 4 10.5,0; 5 14,0; 6 17.5,0; 7 21,0; 8 24.5,0
1X03 = drill 1.016 pad 1.88: 1 0,0; 2 2.54,0; 3 5.08,0
1X02 = drill 1.016 pad 1.88: 1 0,0; 2 2.54,0
RCA = drill 2.8 pad 4.318: PIN 4,3.7; SWITCH 4,-3.7 | drill 2.3: SHELL 0,0 | hole 2.1: -3.1,4.25; -3.1,-4.25
LED-0603 = smd 1 x 1: A 0,-0.877; C 0,0.877
SOT23 = smd 1 x 1.4: 1 -0.95,-1.1; 2 0.95,-1.1; 3 0,1.1
0603-RES = smd 1.1 x 1: 1 -0.85,0; 2 0.85,0
TRIMPOT_TC33 = smd 1.1 x 0.9: 1 -0.91,-1.45; 2 0,1.45; 3 0.91,-1.45
STAND-OFF = hole 3.302: 0,0
B1,27 = smd 1.27 x 1.27: TP 0,0
DPAK = smd 1.6 x 3: 1 -2.28,-5.31; 3 2.28,-5.31 | smd 4.826 x 5.715: 4 0,1.588
SOT-23-6 = smd 0.51 x 0.8: 1 -0.95,-1.3; 2 0,-1.3; 3 0.95,-1.3; 4 0.95,1.3; 5 0,1.3; 6 -0.95,1.3
DF13C-6P-1.25V = smd 1.6 x 2.2: M$0 5.575,-1.8; M$1 -5.575,-1.8 | smd 0.7 x 1.8: P$1 -3.125,0.9; P$2 -1.875,0.9; P$3 -0.625,0.9; P$4 0.625,0.9; P$5 1.875,0.9; P$6 3.125,0.9
SO08' = smd 0.61 x 2.21: 1 -1.905,-2.616; 2 -0.635,-2.616; 3 0.635,-2.616; 4 1.905,-2.616; 5 1.905,2.616; 6 0.635,2.616; 7 -0.635,2.616; 8 -1.905,2.616
SCREWTERMINAL-3.5MM-2 = drill 1.2 pad 2.032 square: 1 0,0 | drill 1.2 pad 2.032: 2 3.5,0
JST-GH-TOP-6 = smd 0.6 x 1.7: 1 6.25,0; 2 5,0; 3 3.75,0; 4 2.5,0; 5 1.25,0; 6 0,0 | smd 1 x 2.8: MECH1 8.05,-3.35; MECH2 -1.85,-3.35
HEADER-2MM-3POS = drill 0.8 pad 1.422: P$1 0,0; P$2 2,0; P$3 4,0
SC70-5L = smd 0.4 x 0.8: 1 -0.65,-0.95; 2 0,-0.95; 3 0.65,-0.95; 4 0.65,0.95; 5 -0.65,0.95
HEADER-2MM-2POS = drill 0.8 pad 1.422: P$1 0,0; P$2 2,0
USB-MINIB = smd 2.5 x 0.5: D+ 2.5,0; D- 2.5,0.8; GND 2.5,-1.6; ID 2.5,-0.8; VBUS 2.5,1.6 | smd 2.5 x 2: GND@1 -3,-4.5; GND@2 -3,4.5; GND@3 2.5,4.5; GND@4 2.5,-4.5 | hole 0.9: 0,2.2; 0,-2.2

### Placement (x,y rotation side)
C1  10.41,10.34 0 top
C2  4.5,15.9 270 top
C3  108.9,25.72 270 top
C4  101.76,20.8 0 top
C5  24.5,15.09 90 top
C6  96.04,19.53 180 top
C7  18.14,12.85 90 top
C8  44.12,16.67 0 top
C9  94.53,13.87 0 top
C10  35.54,21 0 top
C11  72.07,34.29 270 top
C12  18.14,16.43 270 top
C13  45.61,27.8 90 top
C14  92.39,19.53 0 top
C15  86.04,30.96 0 top
C16  84.77,21.11 180 top
C17  108.9,20.48 270 top
C18  75.88,14.29 90 top
C19  83.5,14.29 90 top
C20  80.8,20 90 top
C21  66.99,34.29 90 top
C22  27.27,24.31 270 top
C23  78.11,25.4 0 top
C26  15.98,12.87 90 top
C27  92.39,21.59 0 top
C28  17.35,37.95 180 top
C29  17.25,32.87 0 top
D1  60.63,13.98 90 top
F1  73.34,14.29 90 top
F2  16.03,17.78 270 top
F3  97.16,21.75 0 top
IC1  8.31,15.8 180 top
IC2  103.19,24.45 270 top
IC3  70.8,29.53 270 top
IC4  23.39,24.37 180 top
IC5  76.14,20.22 0 top
JP1  26.06,40.79 180 top
JP2  15.88,6.99 0 top
JP3  12.86,40.83 180 top
JP5  60.39,28.84 270 top
JP6  100.62,5.17 90 top
JP7  100.22,38.87 180 top
JP15  69.22,10.16 90 top
LED1  16.33,27.88 90 top
LED2  87.31,33.02 270 top
Q1  50.64,23.18 270 top
Q2  22,33.57 180 top
Q3  25.67,31.91 180 top
R1  12.73,16.83 270 top
R2  9.61,21.06 0 top
R3  9.64,23.39 180 top
R4  6.97,10.31 0 top
R5  9.46,7.72 0 top
R6  5.87,23.39 0 top
R7  5.87,25.72 180 top
R8  108.9,30.8 90 top
R9  106.36,30.8 270 top
R10  101.28,30.8 270 top
R11  98.74,30.8 270 top
R12  102.71,13.97 180 top
R13  106.36,16.67 270 top
R14  103.82,30.8 90 top
R15  22.03,36.63 0 top
R16  21.16,30.22 180 top
R17  69.53,33.5 180 top
R18  108.9,12.38 180 top
R19  25.67,35.12 0 top
R20  28.63,31.62 90 top
R21  108.9,16.67 270 top
R22  106.36,20.48 270 top
R23  80.96,14.29 90 top
R24  78.42,14.29 90 top
R25  51.91,19.53 270 top
R32  46.99,23.18 90 top
R33  60.64,18.1 90 top
R35  48.18,19.37 180 top
R38  16.32,25.29 180 top
R39  91.12,33.02 180 top
STANDOFF1  3.17,3.17 0 top
STANDOFF2  60.33,3.17 0 top
STANDOFF3  60.33,42.55 0 top
STANDOFF4  3.17,42.55 0 top
STANDOFF5  67.31,3.17 0 top
STANDOFF6  109.22,3.17 0 top
STANDOFF7  67.31,42.55 0 top
STANDOFF8  109.22,42.55 0 top
TP1  2.98,20.35 0 top
TP2  10.32,33.45 0 top
TP3  40.16,33.42 0 top
TP4  60.64,22.43 0 top
TP5  81.28,25.67 0 top
TP6  101.92,18.05 0 top
U1  35.07,27.04 90 top
U2  89.69,26.51 270 top
U5  35.07,14.92 90 top
U$1  21.36,14.66 270 top
U$2  94.28,16.68 180 top
U$3  36.19,39.14 180 top
U$4  35.08,-0.79 0 bottom
U$5  110.31,34.32 90 top
U$6  AO4407A  [SO08']  56.36,19.53 0 top
U$7  LOGOFULL-M  [BR-FULL-LOGO-MEDIUM]  113.03,37.62 270 bottom
U$9  LOGOBR-LOGO-MS  [BR-LOGO-MEDIUM-SMALL-COPPER]  51.1,33.56 270 top
U$10  48.58,7 0 top
U$11  53.86,38.14 180 top
U$12  86.84,6.94 0 top
U$13  47.81,16.35 0 top
U$15  17.34,35.3 90 top
U$16  68.74,37.77 180 top
X2  76.44,5.38 90 top

### Tracks (layer width: path | path; a pad name or v marks a point on that pad's centre or on a via)
3.3V-ISO  (via drill 0.5)
  Top 0.305: U$15.5 16.4,34.64 15.91,34.64 15.24,33.97 15.24,33.34 15.71,32.87 C29.1 16.35,32.82 16.35,31.75 16.83,31.27 v18.73,31.27 | R15.2 22.88,34.74 Q2.1 22.95,33.88 23.5,33.34 v23.5,31.75 23.81,31.91 25.56,31.91 26.62,32.97 Q3.1 26.62,35.02 R19.2
  Bottom 0.305: v23.5,31.75 19.21,31.75 v18.73,31.27
3V3OUT
  Top 0.305: IC5.3 75.35,21.17 | 75.35,21.17 77.15,19.37 77.31,19.37 | 77.31,19.37 78.75,19.37 IC5.11 | IC5.10 78.05,18.63 77.31,19.37 | 75.35,21.17 75.35,23.49 C23.1
12V-ISO  (via drill 0.5)
  Top 0.406: TP2.TP 12.02,33.45 v12.06,33.5
  Top 0.61: U1.3 38.63,29.32 v37.62,30.32
  Top 0.813: C13.+ 43.88,27.88 42.55,29.21 40.48,29.21 U1.3
  Bottom 0.406: v12.06,33.5 10.48,33.5 10.32,33.66
  Bottom 0.61: JP3.2 10.32,33.66 10.32,31.43 11.75,30 32.38,30 32.7,30.32 v37.62,30.32
-VCC
  Top 0.406: 100.89,22.94 100.89,23.42 IC2.4 | TP6.TP 101.92,18.73 100.97,19.68 100.97,20.74
  Top 0.61: C4.1 100.91,22.92 100.89,22.94 | 100.97,20.74 C4.1 | F3.2 99.06,21.75 99.85,20.95 100.75,20.95 C4.1
-VCC-ISO  (via drill 0.5)
  Top 0.406: v4.29,18.73 4.29,18.57 | IC1.4 5.18,18.05 | 5.18,18.05 4.97,18.05 v4.29,18.73 | C2.1 4.5,17.36 5.18,18.05 | v15.4,15.56 16.03,16.14 F2.2 | v4.29,18.73 4.29,19.53 3.65,20.16 3.18,20.16 TP1.TP
  Bottom 0.406: v4.29,18.73 4.45,18.57 4.45,16.03 6.19,14.29 13.97,14.29 v15.4,15.56
-VCC-ISO-PRE
  Top 0.61: U$1.1 20.06,16.45 19.21,17.3 18.17,17.3 C12.1 18.14,17.42 16.99,18.57 16.09,18.57 F2.1
-VCC-PRE
  Top 0.61: F3.1 96.36,21.69 96.36,20.95 96.94,20.37 C6.1 97,19.47 97,18.57 96.4,17.98 U$2.1
CAMERA
  Top 0.406: R7.2 4.13,25.72 3.81,25.4 3.81,23.81 4.23,23.39 R6.1 5.02,21.02 5.56,20.48 6.83,20.48 6.83,20.45 8,19.28 8,18.07 IC1.3 | 5.08,25.78 5.08,28.89 7.62,31.43 7.62,40.67 JP3.3
  Top 0.61: 5.08,25.78 R7.2
GND  (via drill 0.5)
  Top 0.305: IC5.5 74.71,19.9 v75.25,19.37 | IC5.13 80.97,20.54 C20.2
  Top 0.406: 99.69,26.99 99.06,26.99 98.74,27.3
  Top 0.61: R11.1 99.75,31.65 100.17,32.07 100.17,32.89 v98.3,33.56
  Bottom 0.406: 99.82,26.9 99.21,26.9 98.37,27.74 | 97.53,29.18 98.22,29.88 99.75,29.88
  Bottom 0.61: 100.17,20.64 98.58,22.23
  other vias: 80.33,22.38 75.25,16.67 94.61,21.11 94.46,16.67 91.12,13.02 106.83,22.82 100.16,15.01 110.72,16.31 103.23,38.64 102.75,33.24 95.25,24.92 94.93,29.05 93.98,31.59 106.01,27.3 107.66,25.45 84.93,17.3 79.69,12.06 72.23,16.67 72.23,23.97 65.41,24.29 65.56,35.56 73.82,26.19 76.68,21.75 85.09,19.21 90.81,29.84 87.31,28.42 81.44,27.78 66.04,26.83 98.11,26.83 91.12,16.67 74.61,12.06 65.41,8.26 83.19,34.13 93.03,41.59 84.61,41.12 70.48,35.72 80.8,17.46 65.88,28.57 65.41,19.68 69.69,7.94 71.6,10.32 107.67,18.64 101.59,12.31 106.24,33.88 97.95,23.5 78.42,12.06 103.97,19.96 103.97,15.65 100.16,19.14 99.89,22.49 99.81,26.3 102.81,26.71 104.14,22.5 90.01,23.18 93.19,23.18 98.27,20 91.88,29.85 92.99,29.85 94.1,29.85 89.69,29.84 88.58,29.84 87.31,29.53 87.63,27.3 94.93,27.94 95.25,23.81 94.3,23.18 96.2,24.45 96.2,25.56 98.27,12.86 89.53,35.24 90.65,35.24 91.76,35.24 92.87,35.24 79.45,30.47 77.23,27.45 75.16,33.17 78.34,36.18 87.86,17.29 87.86,14.59 87.86,11.89 79.7,32.87 67.7,22.51
  pour Top (isolate 0.254): 99.69,0 99.69,29.05 94.93,33.81 94.93,45.72 114.3,45.72 114.3,0
  pour Bottom (isolate 0.254): 99.69,-2.54 99.69,29.05 94.93,33.81 94.93,48.26 112.39,48.26 112.39,-2.54
  pour Bottom (isolate 0.254): 64.45,-2.54 93.03,-2.54 93.03,12.38 98.74,12.38 98.74,28.89 94.3,33.34 94.3,48.26 64.45,48.26
  pour Top (isolate 0.254, no thermals): 64.45,-1.27 93.03,-1.27 93.03,12.38 98.74,12.38 98.74,28.89 94.3,33.34 94.3,48.26 64.45,48.26
  pour Bottom (isolate 0.254): 93.98,-1.27 93.98,11.59 101.6,11.59 101.6,-1.27
  pour Top (isolate 0.254): 93.98,-2.54 93.98,11.59 101.6,11.59 101.6,-2.54
GND-ISO  (via drill 0.5)
  Top 0.305: U$15.2 17.4,35.3 17.3,35.4
  Top 0.61: 13.81,10.16 13.81,10
  Top 1.016: 12.54,30 17.62,30
  Bottom 0.406: 13.97,13.49 14.13,13.34 15.08,14.29 | 13.81,15.24 13.97,15.24 14.45,15.72 14.61,16.03 15.08,16.51 | 13.81,10 15.08,10 | 13.81,11.59 15.08,11.59
  other vias: 49.21,20.8 40.78,31.16 30.54,31.41 31.43,18.76 13.49,28.73 13.49,31.43 10.64,15.72 11.43,4.29 5.71,7.94 6.19,13.18 3.17,23.02 12.86,20.48 6.19,31.91 16.67,15.08 21.27,16.99 21.11,12.06 15.72,20.32 13.34,23.18 19.84,33.02 18.89,25.4 29.58,26.17 29.58,28.56 44.81,23.05 35.3,18.71 33.38,11.57 34.49,11.57 44.67,18.71 49.09,26.54 37.98,27.17 23.18,4.92 13.34,5.87 13.97,8.26 13.81,12.54 30.32,34.29 37.68,9.82 38.63,10.62 40.52,15.54 40.52,14.43 39.41,15.54 39.41,14.43 35.6,11.57 37.98,26.06 37.98,24.95 41,23.05 20.8,9.84 16.99,9.84 15.71,23.21 11.75,8.73 11.91,24.45 8.1,24.77 20,28.26 29.57,27.37 29.57,24.99 26.56,28.8 23.71,23.48 29.74,20.78 32.06,22.26 37.98,28.29 38.14,15.54 37.03,14.59 38.14,14.59 37.03,13.63 37.03,16.49 37.03,15.54 38.14,13.63 38.14,12.68 37.03,12.68 41.63,15.54 41.63,14.43 37.03,28.92 37.03,27.81 37.03,26.7 37.03,25.43 33.38,23.68 34.49,23.68 35.6,23.68 36.71,23.68 36.39,31.46 39.57,19.08 41.63,19.08 28.31,11.41 22.22,12 23.17,12.63 23.17,11.21 36.71,11.57 37.82,11.57 8.92,35.15 7.49,29.44 6.22,37.53 3.84,27.37 10,29.84 11.75,32.07 18.85,18.72 19.73,36.74 25.93,36.58 15.29,36.74 15.29,31.5 36.83,34.28 43.72,38.23 41.95,34.52 54.02,35.79 28.32,39.01 42.53,10.94 44.91,9.83 42.88,26.53 41.77,26.84 50.21,26.54 51.32,26.54
  pour Top (isolate 0.254): 12.7,-3.33 12.7,8.75 21.11,8.75 21.11,-3.33
  pour Bottom (isolate 0.254, no thermals): 21.91,45.72 63.18,45.72 63.18,-5.08 21.91,-5.08
  pour Top (isolate 0.254, no thermals): 21.91,48.26 63.18,48.26 63.18,27.94 52.23,27.94 52.23,25.08 52.26,23.34 52.26,14.18 49.85,11.64 49.85,-2.54 21.91,-2.54
  pour Top (isolate 0.254): 13.97,-1.27 -1.27,-1.27 -1.27,46.99 13.97,46.99
  pour Bottom (isolate 0.254): 13.97,-2.54 0,-2.54 0,48.26 13.97,48.26
  pour Bottom (isolate 0.254): 21.11,8.73 13.34,8.73 13.34,0 21.11,0
  pour Bottom (isolate 0.254): 14.92,9.53 14.92,46.99 27.29,46.99 27.29,9.53
  pour Top (isolate 0.254): 14.92,9.53 14.92,48.26 24.13,48.26 24.13,9.53
N$1
  Top 0.406: R1.1 12.72,18.59 11.89,19.43 10.13,19.43 9.75,19.81 | 10.21,20.8 R2.2 10.44,21.03 10.44,20.5 9.75,19.81 | IC1.1 9.28,19.34 9.75,19.81
N$2
  Top 0.406: R5.1 7.84,7.72 7.62,7.94 7.62,10.11 R4.2 7.82,11.1 8.61,11.89 8.61,13.53 IC1.7
N$3
  Top 0.61: U$2.5 94.28,14.48 C9.1
N$4
  Top 0.61: U$2.6 95.23,14.01 C9.2
N$5
  Top 0.406: R3.2 8.73,23.34 8.17,23.34 7.78,22.87 7.78,21.43 8.15,21.06 R2.1 8.94,20.88 8.94,20.22 8.61,19.89 8.61,18.07 IC1.2
N$6  (via drill 0.5)
  Top 0.406: R6.2 6.72,21.96 v6.51,21.75 | R4.1 6.12,10.69 8,12.57 8,13.53 IC1.6 7.98,15.04 v7.62,15.4
  Bottom 0.406: v6.51,21.75 6.51,16.51 v7.62,15.4
N$7
  Top 0.406: C11.1 72.07,36.35 70.64,37.78 68.76,37.78 U$16.P$1
N$8
  Top 0.305: R10.2 101.28,27.42 101.65,27.05 101.65,26.36 102.79,25.22 102.79,24.08 103.4,23.47 IC2.5
  Top 0.406: R11.2 R10.2
N$9
  Top 0.305: R9.2 106.36,29.25 103.78,26.67 103.78,24.38 104.09,24.08 105.39,24.08 IC2.6
  Top 0.406: R9.2 R8.1
N$10
  Top 0.61: U$1.5 23.76,14.66 C5.1
N$11
  Top 0.61: U$1.6 23.85,15.61 C5.2
N$12
  Top 0.305: R13.2 106.36,15.24 106.84,14.76 108.88,14.76 R18.1
  Top 0.406: 110.01,13.95 R18.1
N$14  (via drill 0.5)
  Top 0.406: R8.2 v108.9,33.34 | R22.1 C17.1 108.9,23.02 v108.27,23.65 108.1,23.65 107.62,24.13 | 107.63,24.13 107.62,24.13 | 107.62,24.13 106.98,24.77 IC2.7
  Bottom 0.406: v108.9,33.34 108.9,24.29 v108.27,23.65
N$15
  Top 0.305: IC2.2 101.87,24.77 102.18,24.46 102.18,23.16 105.82,19.53 106.26,19.53 106.26,17.62 R13.1 107.26,17.52 107.63,17.14 107.63,16.19 107.95,15.88 108.85,15.88 R21.2
  Top 0.406: 106.26,19.53 R22.2
N$16
  Top 0.305: C17.2 R21.1
N$17  (via drill 0.5)
  Top 0.305: R18.2 108.9,12.38 107.99,13.29 R18.3 105.76,13.83 v104.93,14.66 104.25,13.97 R12.1
  Top 0.406: v99.69,27.94 100.97,26.67 100.97,25.45 IC2.1 | 104.93,14.92 v104.93,14.66 | 108.88,10.95 R18.2
  Bottom 0.406: v99.69,27.94 103.5,27.94 105.09,26.35 v104.93,14.66
N$19  (via drill 0.5)
  Top 0.406: X2.D- 75.64,10.4 v75.09,10.95 | v81.12,10.95 81.12,13.28 R23.1 C19.1
  Bottom 0.406: v75.09,10.95 v81.12,10.95
N$20
  Top 0.406: X2.D+ 76.44,11.5 | 76.44,11.5 75.88,12.06 C18.1 | R24.1 78.38,13.44 76.44,11.5
N$21
  Top 0.406: F1.1 73.34,10.95 74.77,9.53 74.77,7.96 X2.VBUS
N$22
  Top 0.305: R24.2 78.42,15.56 76.04,17.94 73.48,17.94 IC5.8
N$27
  Top 0.406: Q1.1 47.25,24.13 R32.2
N$28  (via drill 0.5)
  Top 0.305: R33.1 60.64,16.19 | 60.64,16.19 60.64,15.47 D1.A | v61.91,16.19 60.64,16.19 | R25.2 52.28,19.05 v58.1,19.05 58.26,18.89 U$6.4
  Bottom 0.305: v58.1,19.05 59.05,19.05 v61.91,16.19
N$29
  Top 0.305: R23.2 80.96,15.89 IC5.9
N$30
  Top 0.406: Q1.3 51.74,20.39 R25.1
N$31
  Top 0.305: R38.2 15.47,27.86 LED1.C
N$32
  Top 0.406: LED2.C R39.2
ROV-BATT
  Top 0.305: 53.89,16.35 U$6.1
  Top 0.406: U$13.P$3 53.89,16.35
  pour Top (isolate 0.254, no thermals): 50.8,-2.54 63.18,-2.54 63.18,19.37 53.5,19.37 53.34,13.97 50.8,11.11
ROV-ON  (via drill 0.5)
  Top 0.406: JP2.7 36.99,6.99 39.85,9.84 43.18,9.84 v45.09,11.75
  Bottom 0.406: v45.09,11.75 45.09,13.62 U$13.P$1
ROV-ON-CTRL
  Top 0.406: JP7.7 78.14,37.78 77.47,37.78 73.13,33.44 C11.2 72.02,33.5 R17.1
ROV-ON-SELECT
  Top 0.305: R32.1 46.99,21.43 46.2,20.64 46.2,19.37 R35.2 47.33,18.84 U$13.P$2
ROV-RX
  Top 0.406: IC4.2 24.03,29.17 Q3.3 28.58,30.82 R20.1
ROV-TP1+
  Top 0.406: JP2.1 13.49,6.99 12.86,7.62 12.86,15.84 R1.2
ROV-TP1-
  Top 0.406: JP2.2 19.38,6.52 17.62,4.76 12.7,4.76 12.06,5.4 12.06,6.99 11.43,7.62 10.41,7.62 R5.2
ROV-TP2+  (via drill 0.5)
  Top 0.406: v23.34,18.1 21.59,19.84 21.59,21.2 IC4.5
  Bottom 0.406: JP2.3 22.88,8.75 24.13,10 24.13,17.3 v23.34,18.1
ROV-TP2-  (via drill 0.5)
  Top 0.406: v24.77,18.41 24.61,18.41 22.86,20.16 22.86,21.2 IC4.6
  Bottom 0.406: JP2.4 26.38,8.55 24.92,10 24.92,18.26 v24.77,18.41
ROV-TP3+  (via drill 0.5)
  Top 0.406: v26.51,20.64 26.51,20.8 26.04,21.27 25.33,21.27 IC4.8
  Bottom 0.406: JP2.5 29.84,6.99 26.51,10.32 v26.51,20.64
ROV-TP3-  (via drill 0.5)
  Top 0.406: IC4.7 24.03,20.26 24.77,19.53 26.51,19.53 v27.62,18.41
  Bottom 0.406: JP2.6 33.38,7.58 32.07,8.89 29.05,8.89 27.3,10.64 27.3,18.1 v27.62,18.41
ROV-TX
  Top 0.406: IC4.3 22.76,29.47 R16.1 22.01,32.46 Q2.3
ROV-VIN  (via drill 0.5, 0.7)
  Top 1.016: U1.1 40.48,24.65 v43.01,24.65 43.01,16.93 C8.1 43.01,16.41 v43.01,12.7 40.44,12.7 U5.1 | v43.01,23.42 v43.01,22.28
  Bottom 1.016: v43.01,24.65 v43.01,22.27 | 43.01,22.11 v43.01,22.27 | v43.01,22.27 v43.01,22.28
  Bottom 1.27: v43.01,24.65 52.07,24.61 v53.58,25.88 58.18,25.88
  other vias: 54.69,25.88 55.8,25.88 56.91,25.88 58.02,25.88
  pour Top (isolate 0.254, no thermals): 53.32,20.36 53.32,27 63.18,26.99 63.18,20.32
RTS  (via drill 0.5)
  Top 0.305: IC5.2 74.51,21.81 74.77,22.07 74.77,24.45 v75.25,24.92
  Top 0.406: v67.31,36.35 67.31,37.19 U$16.P$2
  Bottom 0.305: v75.25,24.92 75.25,26.83 71.75,30.32 69.53,30.32 67.31,32.54 v67.31,36.35
RX-3.3V  (via drill 0.5)
  Top 0.305: U$3.P$3 36.81,36.97 35.88,36.04 29.05,36.04 28.57,36.51 v28.57,37.15 27.15,38.58 25.56,38.58 | JP1.2 23.52,40.29 25.24,38.58 25.56,38.58 | R19.1 24.82,37.2 25.56,37.94 25.56,38.58
  Top 0.406: U$11.3 50.11,36.73 v50.96,35.88 | Q3.2 24.72,35.03 R19.1
  Bottom 0.305: v50.96,35.88 50.32,35.88 49.21,36.99 28.73,36.99 v28.57,37.15
RX-I  (via drill 0.5)
  Top 0.305: v70.8,20 71.6,20 72.07,20.48 73.36,20.48 IC5.4
  Top 0.406: IC3.2 70.17,30.16 v71.12,29.21
  Bottom 0.406: v71.12,29.21 71.12,20.32 v70.8,20 68.74,20 67.31,18.57 67.31,14.61 JP15.2
TOP-TP1+
  Top 0.406: JP7.1 100.22,37.1 103.82,33.5 103.82,33.18 | 103.82,33.18 R14.2 | R9.1 106.36,32.54 105.89,33.02 103.98,33.02 103.82,33.18
TOP-TP1-
  Top 0.406: JP7.2 96.72,37.9 101.28,33.34 | 101.28,33.34 R10.1 | R14.1 103.08,29.95 102.55,30.48 102.55,32.07 101.28,33.34
TOP-TP2+
  Top 0.406: JP7.3 91.29,40.8 89.06,40.8 87.95,39.69 87.95,37.78 86.68,36.51 80.64,36.51 75.56,31.43 IC3.8
TOP-TP2-
  Top 0.406: JP7.4 89.22,38.36 89.22,37.94 87,35.72 81.12,35.72 75.56,30.16 IC3.7
  Bottom 0.406: 89.69,38.84 JP7.4
TOP-TP3+  (via drill 0.5)
  Top 0.406: v81.92,29.21 77.31,29.21 75.72,27.62 IC3.5
  Bottom 0.406: JP7.5 81.92,34.56 v81.92,29.21
TOP-TP3-  (via drill 0.5)
  Top 0.406: v80.8,31.75 78.58,31.75 75.72,28.89 IC3.6
  Bottom 0.406: JP7.6 80.8,36.95 v80.8,31.75
TOP-VIN
  Top 0.406: U2.1 84.38,30.15 C15.1
  Top 1.016: U2.1 87.47,25.7 87.47,23.65 89.53,21.59 89.53,10.32 90.34,9.52 U$12.2
TX-3.3V  (via drill 0.5)
  Top 0.305: U$3.P$2 38.06,36.32 v37.62,35.88 | R15.1 21.18,37.37 22.07,38.26 v24.13,38.26
  Top 0.406: U$11.2 48.86,35.44 v48.9,35.4 | Q2.2 21.05,36.5 R15.1
  Bottom 0.305: v48.9,35.4 44.61,35.4 43.81,36.2 37.94,36.2 v37.62,35.88 27.94,35.88 26.83,36.99 26.83,38.1 | 26.83,38.1 26.83,40.03 JP1.1 | v24.13,38.26 26.67,38.26 26.83,38.1
TX-O  (via drill 0.5)
  Top 0.406: IC5.1 73.42,24.85 70.64,27.62 | 70.64,27.62 69.37,28.89 IC3.3 | v67.15,26.04 69.06,26.04 70.64,27.62
  Bottom 0.406: JP15.1 68.58,10.16 66.52,12.22 66.52,25.4 v67.15,26.04
VCC  (via drill 0.5, 0.8)
  Top 0.305: IC5.12 79.95,19.9 80.64,19.21 81.22,19.21 C20.1
  Top 0.406: C3.1 107.63,26.57 107.45,26.75 | v107.31,27.94 107.31,26.89 107.45,26.75 | v71.12,31.59 71.28,31.43 IC3.1 67.73,31.65 66.99,32.38 C21.1 68.63,33.44 R17.2 | U$2.4 U$2.3 | IC2.8 106.12,25.42 107.45,26.75 | 91.6,21.7 v91.6,23.02 | v83.36,31.39 83.36,32.24 84.14,33.02 LED2.A | TP5.TP 81.71,25.67 82.23,26.19 v83.34,26.19
  Top 0.61: JP15.3 72.89,15.24 F1.2 | C20.1 82.02,17.94 v83.19,17.94 83.37,18.13 C16.A 83.37,20.98 | 91.44,19.47 C14.1 | 91.6,19.63 C14.1 | 91.6,21.7 C27.1 C14.1 | C14.1 91.49,18.68 92.23,17.94 93.29,17.94 U$2.3 | U2.3 84.38,25.15 v83.34,26.19 | 83.5,24.13 83.5,21.11 83.37,20.98 | 83.37,20.98 83.34,20.95
  Bottom 0.406: v83.34,26.19 83.34,28.36 v83.36,31.39 | v91.6,23.02 91.6,25.72 92.08,26.19
  Bottom 0.61: v107.31,27.94 106.2,29.05 98.58,29.05 97.47,27.94 96.68,27.94 94.93,26.19 92.08,26.19 v83.34,26.19 | JP15.3 80.49,15.24 v83.19,17.94 83.34,18.1 v83.34,26.19 | v83.34,26.19 80.33,26.19 74.93,31.59 v71.12,31.59
VCC-ISO  (via drill 0.5)
  Top 0.305: U$15.1 19.41,34.65 19.53,34.77 19.53,35.4 18.97,35.95 U$15.3 18.29,37.86 C28.1
  Top 0.406: U$1.4 U$1.3 | C1.1 9.56,12.3 | 9.56,12.3 9.3,12.57 9.3,13.53 IC1.8 | v11.27,12.54 9.8,12.54 9.56,12.3 | 16.03,10.95 21.91,10.95 23.65,9.21 28.57,9.21 v29.37,10 | C28.1 20.17,37.95 20.95,38.73 20.95,40.77 JP1.3 | IC4.1 25.31,27.46 26.19,27.46 27.27,26.38 C22.1 25.48,25.16 v24.92,24.61 21.27,24.61 18.26,27.62 | R20.2 28.63,34.08 v28.57,34.13 | LED1.A 18,27.88 18.26,27.62 | R16.2 19.58,30.22 18.73,29.37 18.73,28.1 18.26,27.62 | TP3.TP 39.92,33.42 v38.89,34.45
  Top 0.61: U5.3 39.14,17.2 | 36.97,21.45 C10.A | 18.15,11.96 C7.1 | C7.1 18.12,11.97 C26.1 16.03,11.91 16.03,10.95 v15.88,10.79 | C7.1 19.25,11.95 20,12.7 20,13.65 U$1.3 | U$3.P$1 39.31,36.57 40.01,35.88 40.32,35.88 | 40.32,35.88 46.99,35.88 47.62,36.51 47.62,38.13 U$11.1 | v38.89,34.45 40.32,35.88
  Top 1.016: v39.2,22.11 38.05,21 C10.A | 39.14,17.2 36.97,19.26 36.97,21.45
  Bottom 0.406: 39.35,22.27 v39.2,22.11 | v15.88,10.79 13.02,10.79 v11.27,12.54 | v28.57,34.13 28.57,33.34 29.05,32.86 | v24.92,24.61 24.92,23.65 29.74,18.84
  Bottom 0.61: v39.2,22.11 37.92,20.84 31.75,20.84 29.74,18.84 29.37,18.46 v29.37,10 | 37.47,32.7 37.47,33.02 v38.89,34.45
  Bottom 1.016: v39.2,22.11 39.2,30.97 37.47,32.7 37.31,32.86 29.05,32.86 27.62,32.86 20.95,39.53 20.95,40.77 JP1.3
VIDEO-OUT
  Top 0.61: JP6.PIN 98.38,9.16 100.33,11.11 100.33,13.34 100.97,13.97 R12.2

### Text on the board
tPlace: DF13 UART | JST-GH UART | VID | *12V | GND | GND | +5V | RX | TX | 4- / BRN | 4+ / WHT | 3- / GRN | 3+ / WHT | 2- / ORN | 2+ / WHT | 1- / BLU | 1+ / WHT | PAIR#: / COLOR: | Tether | NTSC/PAL / CAMERA | RTS / RESET / JMPR | PWR | PWR | +SW- | FATHOM-S Topside rev5 | GND | JUMPER | UART | 10m | +5V | TETHER / PWR-SW | ALWAYS / ON | RX | 700m | TX | Length | 300m | 200m | 100m | FATHOM-S ROV Board rev5 | Tether | PWR IN | PAIR#: / COLOR: | 1+ / WHT | 1- / BLU | 2+ / WHT | 2- / ORN | 3+ / WHT | 3- / GRN | 4+ / WHT | 4- / BRN | PWR IN | - | + | - | +
bPlace: DroneCode Mini Compatible | 4/16 | 4/16 | *Only if VBAT>13V
Reference: <-- VSCORE